# EAGLE board frontplatine_v0.2_140202 (EAGLE 6.3), part 1 of 2
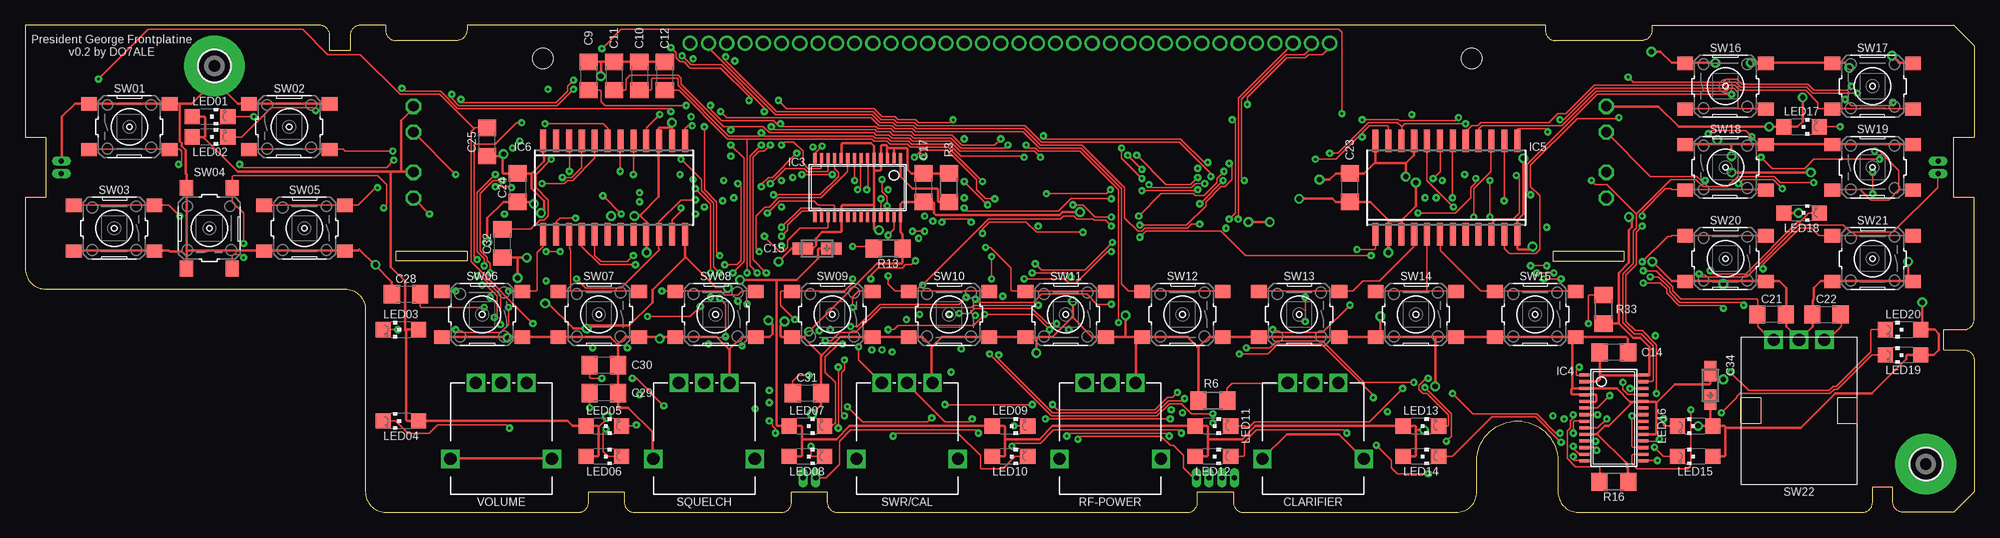
[diagram p2: board, top side]
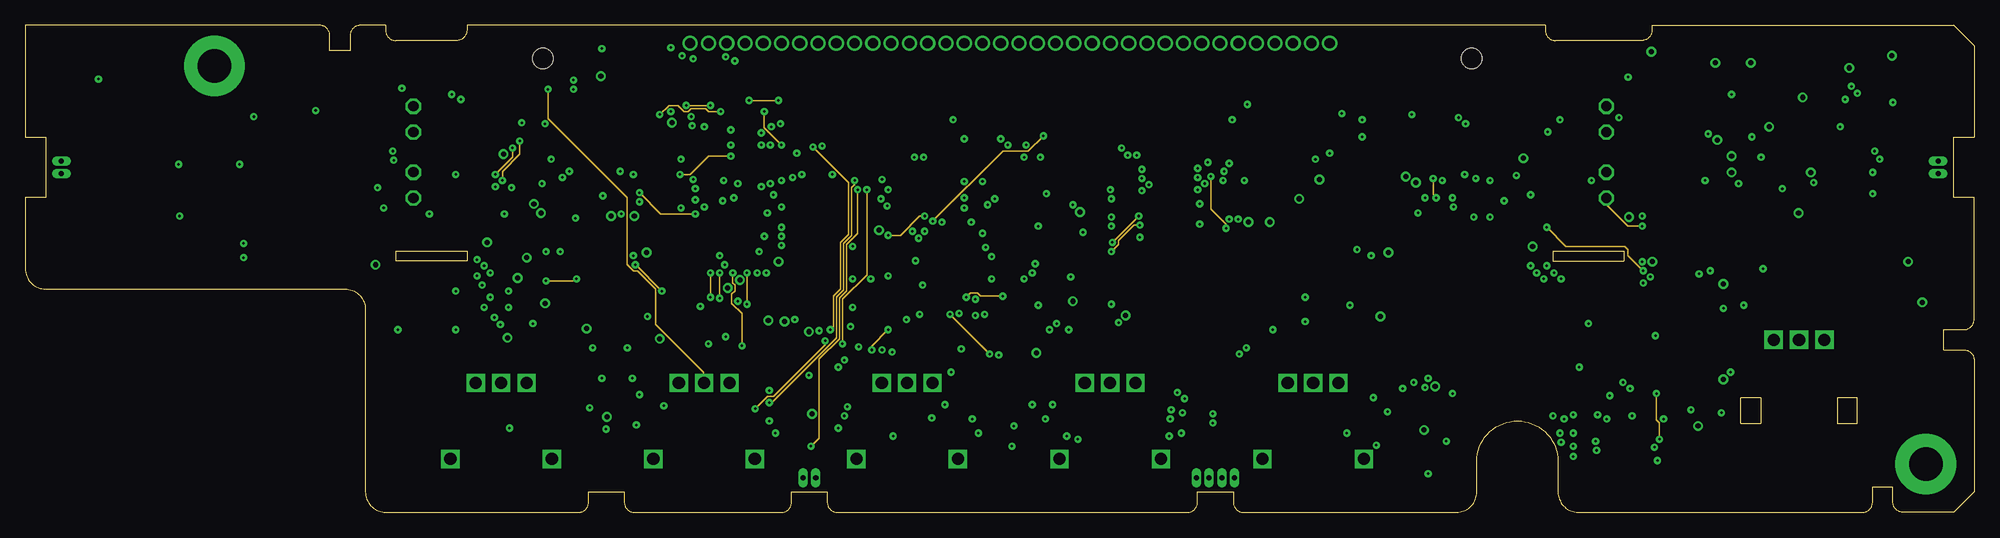
[diagram p3: board, inner layer Route2]
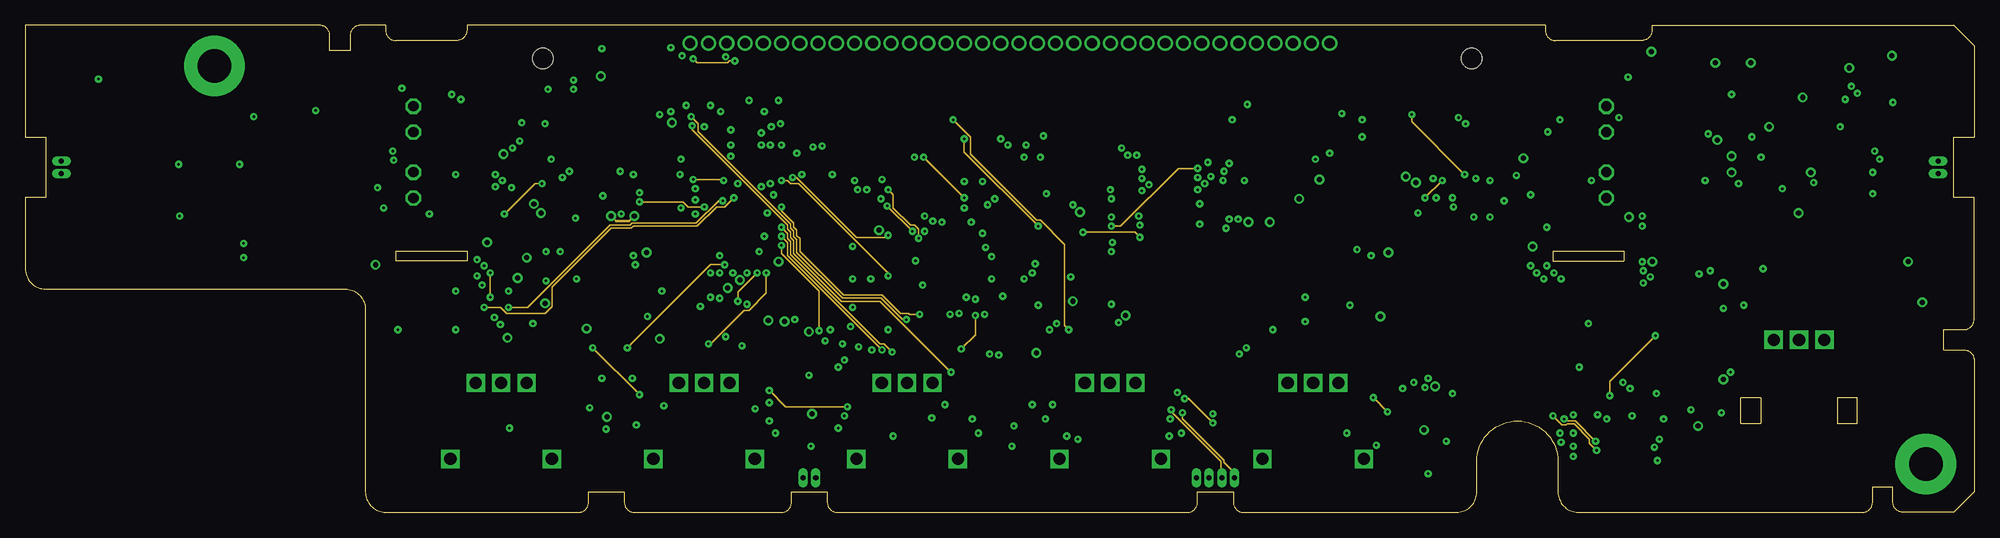
[diagram p4: board, inner layer Route3]
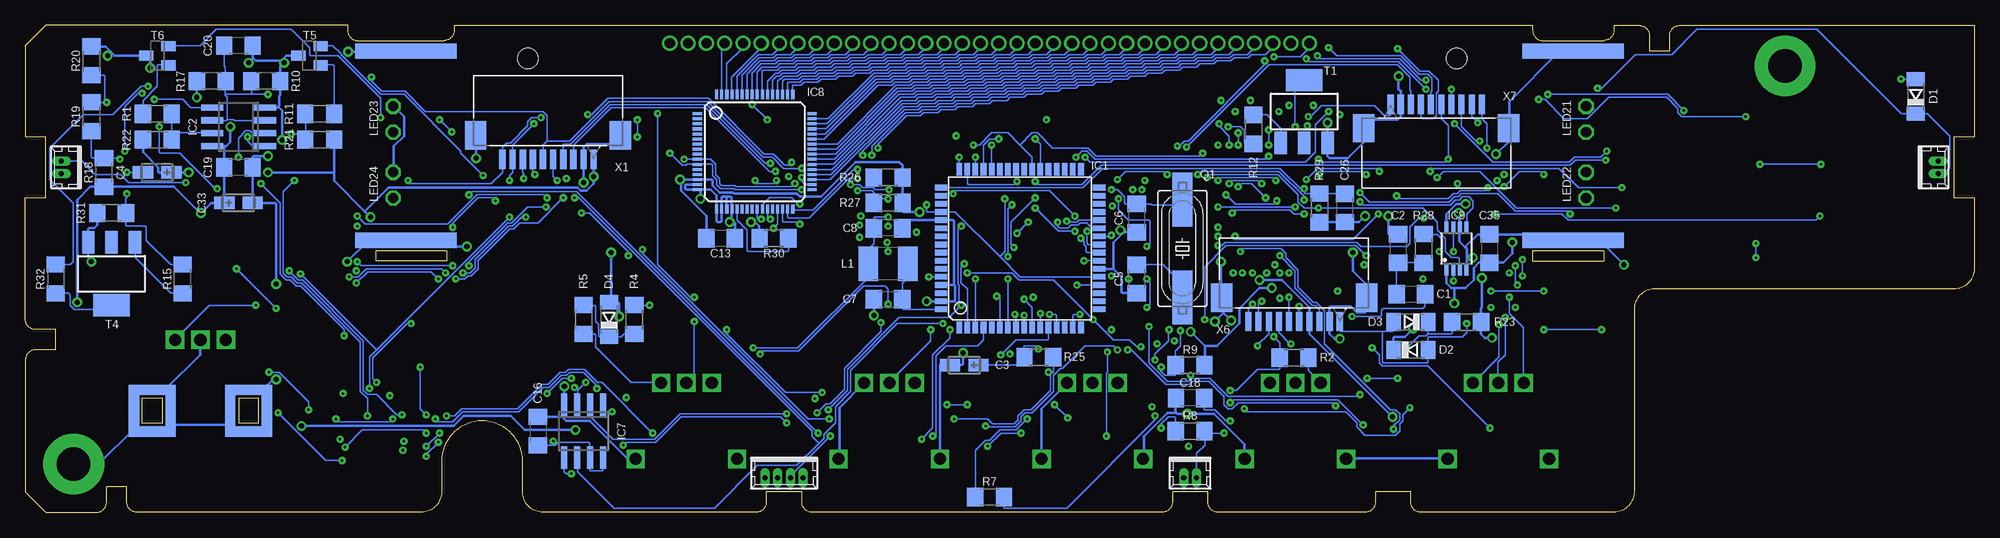
[diagram p5: board, bottom side, seen from below]

Size 192 x 48 mm. Coordinates in mm from the lower left corner, seen from the top.
Outline: 150.75,46.5 159.25,46.5 arc90 160.25,47.5 160.25,48
Outline: 43.5,48 149.75,48 149.75,47.5 arc90 150.76,46.5
Outline: 35.5,48 33,48 arc90 32,47 32,45.5 30,45.5 30,47 arc90 29,48 0,48 0,37 2,37 2,31 0,31 0,24 arc90 2,22 31.5,22 arc-90 33.5,20 33.5,2 arc90 35.5,0 54.5,0 arc90 55.5,1 55.5,2 59,2 59,1 arc90 60,0 74.5,0 arc90 75.5,1 75.5,2 79,2 79,1 arc90 80,0 114.5,0 arc90 115.5,1 115.5,2 119,2 119,1 arc90 120,0 141,0 arc90 143,2 143,5 arc-90 147,9 arc-90 151,5 151,2 arc90 153,0 181,0 arc90 182,1 182,2.5 184,2.5 184,1 arc90 185,0 190,0 192,2 192,15 arc90 191,16 189,16 189,18 191,18 arc90 192,19 192,31 190,31 190,37 192,37 192,46 190,48 160.25,48
Outline: 43.5,48 43.5,47.5 arc-90 42.5,46.5 36.5,46.5 arc-90 35.5,47.5 35.5,48
Copper layers (1*2+3*4+5*6+7*16): Top 0.035mm / dielectric 0.2mm / Route2 0.035mm / dielectric 0.15mm / Route3 0.035mm / dielectric 0.2mm / Route4 0.035mm / dielectric 0.15mm / Route5 0.035mm / dielectric 0.2mm / Route6 0.035mm / dielectric 0.15mm / Route7 0.035mm / dielectric 0.2mm / Bottom 0.035mm
Design rules "Eagle_WEdirekt_125_check": minimum track width 5mil, minimum drill 0.2mm, track to track 5mil, track to pad 5mil, pad to pad 7mil, via to via 5mil, smd to smd 7mil, copper to edge 12mil, drill to drill 24mil, minimum pad ring 9mil, minimum via ring 9mil, stop-mask expansion 2mil, vias tented up to drill 0mil, thermal gap 12mil
Net classes: 0 default: width 0.125 mm, drill 0.25 mm; 1 GND: width 0.25 mm, drill 0.5 mm; 2 SUPPLY LED: width 0.25 mm, drill 0.5 mm; 3 LCD: width 0.075 mm, drill 0.25 mm
tKeepout: area 184,8.5 to 187,11.5; area 160.5,11 to 163.5,14; area 163,0 to 166,3; area 37.5,3.5 to 40.5,6.5; area 149.5,11 to 152.5,14; area 92,11 to 95,14; area 36.5,11 to 39.5,14
tRestrict: area 190,37 to 192,40; area 73.5,0 to 81,2.3; area 53.5,0 to 61,2.3; area 113.5,0 to 121,2.3; area 0,37 to 2,40
bRestrict: area 190,37 to 192,40; area 73.5,0 to 81,2.3; area 53.5,0 to 61,2.3; area 113.5,0 to 121,2.3; area 0,37 to 2,40
vRestrict: area 190,37 to 192,40; area 73.5,0 to 81,2.3; area 53.5,0 to 61,2.3; area 113.5,0 to 121,2.3; area 0,37 to 2,40

## Footprints (pad centres in the part's own frame; a part is rotated, then mirrored left to right if it is on the bottom)
C1206 = smd 1.6 x 1.8: 1 -1.4,0; 2 1.4,0
CT3216 = smd 2 x 1.2: + -1.4,0; - 1.4,0
POTI = drill 1.2 square: 1 -2.5,-7.5; 2 0,-7.5; 3 2.5,-7.5; 4 -5,0; 5 5,0
SOD80C = smd 1.4 x 1.8: A 1.7,0; C -1.7,0
DISPLAY = drill 1 octagon: A1 1.73,15.27; A2 1.73,8.77; A3 119.27,15.27; A4 119.27,8.77; K1 1.73,12.73; K2 1.73,6.23; K3 119.27,12.73; K4 119.27,6.23 | drill 1: COM1 88.4,21.5; COM2 90.2,21.5; COM3 92,21.5; SEG01 29,21.5; SEG02 30.8,21.5; SEG03 32.6,21.5; SEG04 34.4,21.5; SEG05 36.2,21.5; SEG06 38,21.5; SEG07 39.8,21.5; SEG08 41.6,21.5; SEG09 43.4,21.5; SEG10 45.2,21.5; SEG11 47,21.5; SEG12 48.8,21.5; SEG13 50.6,21.5; SEG14 52.4,21.5; SEG15 54.2,21.5; SEG16 56,21.5; SEG17 57.8,21.5; SEG18 59.6,21.5; SEG19 61.4,21.5; SEG20 63.2,21.5; SEG21 65,21.5; SEG22 66.8,21.5; SEG23 68.6,21.5; SEG24 70.4,21.5; SEG25 72.2,21.5; SEG26 74,21.5; SEG27 75.8,21.5; SEG28 77.6,21.5; SEG29 79.4,21.5; SEG30 81.2,21.5; SEG31 83,21.5; SEG32 84.8,21.5; SEG33 86.6,21.5 | smd 10 x 1.5 bottom: GND@0 118,2.055; GND@3 3,2.055; GND@6 3,20.695; GND@7 118,20.695 | hole 2: 14.5,20; 106,20
TQFP64 = smd 1.194 x 0.559: 1 -7.8,6; 2 -7.8,5.2; 3 -7.8,4.4; 4 -7.8,3.6; 5 -7.8,2.8; 6 -7.8,2; 7 -7.8,1.2; 8 -7.8,0.4; 9 -7.8,-0.4; 10 -7.8,-1.2; 11 -7.8,-2; 12 -7.8,-2.8; 13 -7.8,-3.6; 14 -7.8,-4.4; 15 -7.8,-5.2; 16 -7.8,-6; 33 7.8,-6; 34 7.8,-5.2; 35 7.8,-4.4; 36 7.8,-3.6; 37 7.8,-2.8; 38 7.8,-2; 39 7.8,-1.2; 40 7.8,-0.4; 41 7.8,0.4; 42 7.8,1.2; 43 7.8,2; 44 7.8,2.8; 45 7.8,3.6; 46 7.8,4.4; 47 7.8,5.2; 48 7.8,6 | smd 0.559 x 1.194: 17 -6,-7.8; 18 -5.2,-7.8; 19 -4.4,-7.8; 20 -3.6,-7.8; 21 -2.8,-7.8; 22 -2,-7.8; 23 -1.2,-7.8; 24 -0.4,-7.8; 25 0.4,-7.8; 26 1.2,-7.8; 27 2,-7.8; 28 2.8,-7.8; 29 3.6,-7.8; 30 4.4,-7.8; 31 5.2,-7.8; 32 6,-7.8; 49 6,7.8; 50 5.2,7.8; 51 4.4,7.8; 52 3.6,7.8; 53 2.8,7.8; 54 2,7.8; 55 1.2,7.8; 56 0.4,7.8; 57 -0.4,7.8; 58 -1.2,7.8; 59 -2,7.8; 60 -2.8,7.8; 61 -3.6,7.8; 62 -4.4,7.8; 63 -5.2,7.8; 64 -6,7.8
SO08 = smd 0.6 x 2.2: 1 -1.905,-2.6; 2 -0.635,-2.6; 3 0.635,-2.6; 4 1.905,-2.6; 5 1.905,2.6; 6 0.635,2.6; 7 -0.635,2.6; 8 -1.905,2.6
TSSOP28 = smd 0.305 x 0.991: 1 -4.225,-2.918; 2 -3.575,-2.918; 3 -2.925,-2.918; 4 -2.275,-2.918; 5 -1.625,-2.918; 6 -0.975,-2.918; 7 -0.325,-2.918; 8 0.325,-2.918; 9 0.975,-2.918; 10 1.625,-2.918; 11 2.275,-2.918; 12 2.925,-2.918; 13 3.575,-2.918; 14 4.225,-2.918; 15 4.225,2.918; 16 3.575,2.918; 17 2.925,2.918; 18 2.275,2.918; 19 1.625,2.918; 20 0.975,2.918; 21 0.325,2.918; 22 -0.325,2.918; 23 -0.975,2.918; 24 -1.625,2.918; 25 -2.275,2.918; 26 -2.925,2.918; 27 -3.575,2.918; 28 -4.225,2.918
SO24 = smd 0.6 x 2.2: 1 -6.985,-4.6; 2 -5.715,-4.6; 3 -4.445,-4.6; 4 -3.175,-4.6; 5 -1.905,-4.6; 6 -0.635,-4.6; 7 0.635,-4.6; 8 1.905,-4.6; 9 3.175,-4.6; 10 4.445,-4.6; 11 5.715,-4.6; 12 6.985,-4.6; 13 6.985,4.6; 14 5.715,4.6; 15 4.445,4.6; 16 3.175,4.6; 17 1.905,4.6; 18 0.635,4.6; 19 -0.635,4.6; 20 -1.905,4.6; 21 -3.175,4.6; 22 -4.445,4.6; 23 -5.715,4.6; 24 -6.985,4.6
SO-08 = smd 0.6 x 2.2: 1 -1.905,-2.6; 2 -0.635,-2.6; 3 0.635,-2.6; 4 1.905,-2.6; 5 1.905,2.6; 6 0.635,2.6; 7 -0.635,2.6; 8 -1.905,2.6
LQFP-ST-64-2 = smd 0.9 x 0.3: 1 -5.65,3.75; 2 -5.65,3.25; 3 -5.65,2.75; 4 -5.65,2.25; 5 -5.65,1.75; 6 -5.65,1.25; 7 -5.65,0.75; 8 -5.65,0.25; 9 -5.65,-0.25; 10 -5.65,-0.75; 11 -5.65,-1.25; 12 -5.65,-1.75; 13 -5.65,-2.25; 14 -5.65,-2.75; 15 -5.65,-3.25; 16 -5.65,-3.75; 33 5.65,-3.75; 34 5.65,-3.25; 35 5.65,-2.75; 36 5.65,-2.25; 37 5.65,-1.75; 38 5.65,-1.25; 39 5.65,-0.75; 40 5.65,-0.25; 41 5.65,0.25; 42 5.65,0.75; 43 5.65,1.25; 44 5.65,1.75; 45 5.65,2.25; 46 5.65,2.75; 47 5.65,3.25; 48 5.65,3.75 | smd 0.3 x 0.9: 17 -3.75,-5.65; 18 -3.25,-5.65; 19 -2.75,-5.65; 20 -2.25,-5.65; 21 -1.75,-5.65; 22 -1.25,-5.65; 23 -0.75,-5.65; 24 -0.25,-5.65; 25 0.25,-5.65; 26 0.75,-5.65; 27 1.25,-5.65; 28 1.75,-5.65; 29 2.25,-5.65; 30 2.75,-5.65; 31 3.25,-5.65; 32 3.75,-5.65; 49 3.75,5.65; 50 3.25,5.65; 51 2.75,5.65; 52 2.25,5.65; 53 1.75,5.65; 54 1.25,5.65; 55 0.75,5.65; 56 0.25,5.65; 57 -0.25,5.65; 58 -0.75,5.65; 59 -1.25,5.65; 60 -1.75,5.65; 61 -2.25,5.65; 62 -2.75,5.65; 63 -3.25,5.65; 64 -3.75,5.65
MSOP8 = smd 0.4 x 1.2: 1 -0.975,-2.05; 2 -0.325,-2.05; 3 0.325,-2.05; 4 0.975,-2.05; 5 0.975,2.05; 6 0.325,2.05; 7 -0.325,2.05; 8 -0.975,2.05
L1812 = smd 1.9 x 3.4: 1 -1.95,0; 2 1.95,0
CHIPLED_1206 = smd 1.5 x 1.5: A 0,-1.75; C 0,1.75
LOCH = drill 3.3 pad 6: B3,0 0,0
HC49UP = smd 5.334 x 1.93: 1 -4.826,0; 2 4.826,0
R1206 = smd 1.6 x 1.803: 1 -1.422,0; 2 1.422,0
TASTER = smd 1.55 x 1.3: 1 -3.975,2.25; 2 3.975,2.25; 3 -3.975,-2.25; 4 3.975,-2.25
ROTARY_SWITCH = drill 1.2 square: A -2.5,-7; B 2.5,-7; C 0,-7 | smd 1 x 5.11 bottom: GND@1 -6.555,0; GND@2 -2.945,0; GND@3 6.555,0; GND@4 2.945,0 | smd 2.61 x 1 bottom: GND@5 -4.75,2.055; GND@6 -4.75,-2.055; GND@7 4.75,2.055; GND@8 4.75,-2.055
SOT223 = smd 1.219 x 2.235: 1 -2.311,-3.099; 2 0,-3.099; 3 2.311,-3.099 | smd 3.6 x 2.2: 4 0,3.099
SOT23-BEC = smd 1 x 1.4: B -0.95,-1.1; C 0,1.1; E 0.95,-1.1
MOLEX_52207-1085 = smd 0.61 x 1.905: 1 4.496,4.801; 2 3.505,4.801; 3 2.489,4.801; 4 1.499,4.801; 5 0.508,4.801; 6 -0.508,4.801; 7 -1.499,4.801; 8 -2.489,4.801; 9 -3.505,4.801; 10 -4.496,4.801 | smd 2.108 x 2.794: 11 -7.137,7.137; 12 7.137,7.137
53047-02 = drill 0.5 pad 0.698 long: 1 0.625,0.45; 2 -0.625,0.45
53047-04 = drill 0.5 pad 0.698 long: 1 1.875,0.45; 2 0.625,0.45; 3 -0.625,0.45; 4 -1.875,0.45

## Placement (x,y rotation side)
C1  0,047µF  [C1206]  55.5,21.5 0 bottom
C2  0,022µF  [C1206]  56.75,26 270 bottom
C3  22µF  [CT3216]  99.5,14.5 180 bottom
C4  10µF  [CT3216]  179,33.5 180 bottom
C5  22pF  [C1206]  82.5,23 90 bottom
C6  22pF  [C1206]  82.5,29 90 bottom
C7  100nF  [C1206]  107,21 0 bottom
C8  100nF  [C1206]  107,28 180 bottom
C9  1nF  [C1206]  55.5,43 270 top
C10  1nF  [C1206]  60.5,43 270 top
C11  1nF  [C1206]  58,43 270 top
C12  1nF  [C1206]  63,43 270 top
C13  100nF  [C1206]  123.5,27 180 bottom
C14  100nF  [C1206]  156.5,15.75 180 top
C15  22µF  [CT3216]  78,26 180 top
C16  100nF  [C1206]  141.5,8 270 bottom
C17  100nF  [C1206]  88.5,32 270 top
C18  1nF  [C1206]  77.25,11.25 180 bottom
C19  100nF  [C1206]  171,34 180 bottom
C20  1nF  [C1206]  171,46 180 bottom
C21  1µF  [C1206]  172.05,19.5 180 top
C22  1µF  [C1206]  177.45,19.5 0 top
C23  100nF  [C1206]  130.5,32 90 top
C24  100nF  [C1206]  48.5,32 270 top
C25  1nF  [C1206]  45.5,36.5 90 top
C26  1nF  [C1206]  62,30 90 bottom
C28  1nF  [C1206]  37.5,21.5 0 top
C29  1nF  [C1206]  57,11.75 180 top
C30  1nF  [C1206]  57,14.5 0 top
C31  1nF  [C1206]  77,11.75 0 top
C32  1nF  [C1206]  47,26.5 90 top
C33  22µF  [CT3216]  171,30.5 0 bottom
C34  22µF  [CT3216]  166,12.5 90 top
C35  100nF  [C1206]  47.75,26 270 bottom
CLARIFIER  POTI  [POTI]  126.88,5.25 180 top
D1  RLS4148  [SOD80C]  5.75,41 90 bottom
D2  RLS4148  [SOD80C]  55.5,16 0 bottom
D3  RLS4148  [SOD80C]  55.5,18.75 180 bottom
D4  RLZTE-115.1B  [SOD80C]  134.5,19 90 bottom
DISPLAY1  DISPLAY  [DISPLAY]  36.5,24.75 0 top
IC1  MEGA128-A  [TQFP64]  94,26 90 bottom
IC2  LM393D  [SO08]  171,38 90 bottom
IC3  TLC59116  [TSSOP28]  82,32 180 top
IC4  TLC59116  [TSSOP28]  156.5,9.3 270 top
IC5  PCA9555D  [SO24]  140,32 0 top
IC6  PCA9555D  [SO24]  58,32 180 top
IC7  25LC080SN  [SO-08]  137,8 180 bottom
IC8  PCF8576  [LQFP-ST-64-2]  120.14,35.54 0 bottom
IC9  ISL95811UFUZ  [MSOP8]  51,26 0 bottom
L1  10µH  [L1812]  107,24.5 180 bottom
LED01  G  [CHIPLED_1206]  18.2,39 270 top
LED02  R  [CHIPLED_1206]  18.2,37 270 top
LED03  G  [CHIPLED_1206]  37,18 90 top
LED04  R  [CHIPLED_1206]  37,9 90 top
LED05  G  [CHIPLED_1206]  57,8.5 270 top
LED06  R  [CHIPLED_1206]  57,5.5 270 top
LED07  G  [CHIPLED_1206]  77,8.5 270 top
LED08  R  [CHIPLED_1206]  77,5.5 270 top
LED09  G  [CHIPLED_1206]  97,8.5 270 top
LED10  R  [CHIPLED_1206]  97,5.5 270 top
LED11  G  [CHIPLED_1206]  117,8.5 270 top
LED12  R  [CHIPLED_1206]  117,5.5 270 top
LED13  G  [CHIPLED_1206]  137.5,8.5 270 top
LED14  R  [CHIPLED_1206]  137.5,5.5 270 top
LED15  G  [CHIPLED_1206]  164.5,5.5 90 top
LED16  R  [CHIPLED_1206]  164.5,8.5 90 top
LED17  G  [CHIPLED_1206]  175,38 270 top
LED18  R  [CHIPLED_1206]  175,29.5 270 top
LED19  G  [CHIPLED_1206]  185,15.5 90 top
LED20  R  [CHIPLED_1206]  185,18 90 top
LOCH1  LOCH  [LOCH]  18.62,44 0 top
LOCH2  LOCH  [LOCH]  187.25,4.75 0 top
Q1  Farnell: 1640903RL  [HC49UP]  78,26 90 bottom
R1  3,3k  [R1206]  179,39.27 0 bottom
R2  4,7k  [R1206]  67,15.25 180 bottom
R3  1k  [R1206]  91,32 270 top
R4  220  [R1206]  132,19 90 bottom
R5  4,7k  [R1206]  137,19 90 bottom
R6  33k  [R1206]  117,11 180 top
R7  1k  [R1206]  97,1.5 0 bottom
R8  1k  [R1206]  77.25,8 0 bottom
R9  47k  [R1206]  77.25,14.5 180 bottom
R10  220k  [R1206]  168.32,42.5 180 bottom
R11  3,3k  [R1206]  163,39.27 180 bottom
R12  3,3k  [R1206]  71,37.75 90 bottom
R13  10k  [R1206]  85,26 180 top
R15  47k  [R1206]  176.5,23 90 bottom
R16  1k  [R1206]  156.5,3 180 top
R17  220k  [R1206]  173.68,42.5 180 bottom
R18  10k  [R1206]  184.25,33.5 270 bottom
R19  1k  [R1206]  185.5,39 270 bottom
R20  10k  [R1206]  185.5,44.5 270 bottom
R21  3,3k  [R1206]  163,36.73 180 bottom
R22  3,3k  [R1206]  179,36.73 0 bottom
R23  220  [R1206]  50,18.75 180 bottom
R25  470  [R1206]  92.15,15.3 0 bottom
R26  10k  [R1206]  107,33 0 bottom
R27  10k  [R1206]  107,30.5 0 bottom
R28  50k  [R1206]  54.25,26 270 bottom
R29  47k  [R1206]  64.5,30 90 bottom
R30  0  [R1206]  118.25,27 0 bottom
R31  1M  [R1206]  183.5,29.5 180 bottom
R32  10k  [R1206]  189,23 270 bottom
R33  10k  [R1206]  155.5,20 90 top
RF-POWER  POTI  [POTI]  106.88,5.25 180 top
SQUELCH  POTI  [POTI]  66.88,5.25 180 top
SW01  [TASTER]  10.25,38 0 top
SW02  [TASTER]  26,38 0 top
SW03  [TASTER]  8.75,28 180 top
SW04  [TASTER]  18.12,28 90 top
SW05  [TASTER]  27.5,28 180 top
SW06  [TASTER]  45,19.5 180 top
SW07  [TASTER]  56.5,19.5 180 top
SW08  [TASTER]  68,19.5 180 top
SW09  [TASTER]  79.5,19.5 180 top
SW10  [TASTER]  91,19.5 180 top
SW11  [TASTER]  102.5,19.5 180 top
SW12  [TASTER]  114,19.5 180 top
SW13  [TASTER]  125.5,19.5 180 top
SW14  [TASTER]  137,19.5 180 top
SW15  [TASTER]  148.75,19.5 180 top
SW16  [TASTER]  167.5,42 0 top
SW17  [TASTER]  182,42 0 top
SW18  [TASTER]  167.5,34 0 top
SW19  [TASTER]  182,34 0 top
SW20  [TASTER]  167.5,25 180 top
SW21  [TASTER]  182,25 180 top
SW22  ROTARY_SWITCH  [ROTARY_SWITCH]  174.75,10 180 top
SWR/CAL  POTI  [POTI]  86.88,5.25 180 top
T1  PZT2222A  [SOT223]  66,39.5 0 bottom
T4  PZT2222A  [SOT223]  183.5,23.5 180 bottom
T5  BCX19SMD  [SOT23-BEC]  164,45 90 bottom
T6  BCX19SMD  [SOT23-BEC]  179,45 90 bottom
VOLUME  POTI  [POTI]  46.88,5.25 180 top
X1  52207-1085  [MOLEX_52207-1085]  140.5,30 0 bottom
X2  Goldcap  [53047-02]  4,34 270 bottom
X3  I/O  [53047-04]  117.25,3.85 180 bottom
X4  I2C  [53047-02]  188,34 90 bottom
X5  PTT/+-  [53047-02]  77.25,3.85 180 bottom
X6  52207-1085  [MOLEX_52207-1085]  67,14 0 bottom
X7  52207-1085  [MOLEX_52207-1085]  53,45 180 bottom

## Tracks (layer width: path | path; a pad name or v marks a point on that pad's centre or on a via)
GND  (via drill 0.5)
  Top 0.25: X2.2 3.6,34.7 3.6,39 4.9,40.3 6.2,40.3 SW01.1 6.3,40.3 14.2,40.3 SW01.2 14.3,40.3 15.2,40.3 | SW02.2 29.9,40.3 22.1,40.3 SW02.1 22,40.3 20.9,40.3 18.7,42.5 18.7,44 LOCH1.B3,0 18.6,42.5 16.4,40.3 15.2,40.3 | C28.1 36.1,22.7 34.45,24.35 | 34.45,24.35 32.9,25.9 32.8,25.8 31.5,25.8 SW05.1 31.4,25.8 23.6,25.8 SW05.2 23.5,25.8 15.9,25.8 | SW03.2 4.8,25.8 12.7,25.8 SW03.1 12.8,25.8 14.1,25.8 14.2,25.7 15.4,25.7 15.9,25.2 | 15.9,25.2 15.9,24.1 SW04.1 | 15.9,25.2 15.9,25.8 | 15.9,25.8 15.9,31.9 SW04.2 15.9,32.1 15.9,33.3 15.8,33.4 15.8,35.7 15.4,36.1 15.4,36.4 15.2,36.6 15.2,40.3 | v49.4,25.1 48.5,25.1 | 48.5,25.1 C32.1 | 49.9,33.4 C24.1 47.1,33.4 47,33.5 47,34.8 46.8,35 | 49.9,33.4 51.1,34.6 51.1,35.1 51,35.2 IC6.12 | C25.1 46.7,35.1 46.8,35 | 46.8,35 v47.1,35.3 | v50.8,29.5 51.1,29.8 51.1,30.7 49.9,31.9 49.9,33.4 | v34.5,24.4 34.45,24.35 | 56.7,44.4 C11.1 C10.1 C12.1 | 56.7,44.4 C9.1 | 63.6,37.9 62.5,37.9 62.4,37.8 62.4,36.6 IC6.3 62.4,36.5 62.4,31.1 60.6,29.3 60.6,29.2 | 63.6,37.9 63.7,37.8 63.7,36.6 IC6.2 | v63.7,38.4 63.7,37.9 63.6,37.9 | v56.7,43 56.7,44.4 | VOLUME.5 41.9,5.3 51.8,5.3 VOLUME.4 | 47.5,17.3 48.9,17.3 SW06.1 49,17.3 52.5,17.3 SW07.2 52.6,17.3 57.6,17.3 58.3,16.6 58.4,16.6 | 47.5,17.3 41.1,17.3 SW06.2 | v47.5,17.2 47.5,17.3 | 60.6,29.2 61.2,28.6 61.2,27.4 IC6.21 61.2,27.3 v61.2,25.6 | v60,29.2 60.6,29.2 | 62.5,17.3 64,17.3 SW08.2 64.1,17.3 68.1,17.3 69.3,16.1 69.4,16.1 | 62.5,17.3 60.5,17.3 SW07.1 60.4,17.3 59.1,17.3 58.4,16.6 | v62.5,17.1 62.5,17.3 | 58.4,16.6 C30.2 C29.1 58.4,10.4 58.5,10.3 59.4,10.3 61.8,7.9 61.8,5.3 SQUELCH.5 | R3.1 91,33.4 C17.1 87.3,33.4 86.9,33.8 86.9,35.8 86.8,35.9 85.6,35.9
  Top 0.25: 84.9,35.9 84.9,35 IC3.3 | 84.9,35.9 84.9,36.1 84.8,36.2 84.4,36.2 84.3,36.1 84.3,35 IC3.4 84.3,34.8 84.3,33.8 84.2,33.7 83.7,33.7 | 85.6,35.9 85.6,35 IC3.2 | 84.9,35.9 85.6,35.9 | IC3.10 80.4,35 80.4,36.3 80.5,36.4 83.3,36.4 83.6,36.1 83.6,35 IC3.5 83.6,34.8 83.6,33.8 83.7,33.7 | 83.5,30.3 80.5,30.3 80.4,30.2 80.4,29.1 IC3.19 80.4,29 80.4,27.7 80.3,27.6 78.5,27.6 77.9,27 77.9,26.3 77.6,26 C15.- 75.5,26 v74.2,24.7 | 83.5,30.3 83.6,30.2 83.6,29.1 IC3.24 83.6,29 83.6,27.9 83.7,27.8 v84.1,27.8 | 83.7,33.7 83.6,33.7 83.6,30.3 83.5,30.3 | 99.6,17.2 v99.6,15.7 | 99.6,17.2 99.5,17.3 98.6,17.3 SW11.2 98.5,17.3 95,17.3 SW10.1 94.9,17.3 90.3,17.3 89.4,16.4 89.3,16.4 | v77.5,9.7 78.4,10.6 C31.2 78.4,15.5 | v73.2,18.9 73.6,18.5 73.6,17.6 73.3,17.3 72,17.3 SW08.1 71.9,17.3 70.6,17.3 69.4,16.1 | v74.8,18.8 74.4,18.4 74.4,17.4 74.5,17.3 75.5,17.3 SW09.2 75.6,17.3 76.6,17.3 78.4,15.5 | 78.4,15.5 78.5,15.5 80.3,17.3 83.4,17.3 SW09.1 83.5,17.3 87,17.3 SW10.2 87.1,17.3 88.4,17.3 89.3,16.4 | 69.4,16.1 69.4,12.8 SQUELCH.1 | 89.3,16.4 89.3,12.8 SWR/CAL.1 | v48.5,23.1 48.5,25.1 | 168.1,36.3 171.4,36.3 SW18.2 171.5,36.3 178,36.3 SW19.1 178.1,36.3 185.9,36.3 SW19.2 | 168.1,36.3 166.7,36.3 | 166.7,36.3 163.6,36.3 SW18.1 | 168.1,36.3 v168.1,35.1 | v166.5,44.3 163.6,44.3 SW16.1 163.5,44.3 162.2,44.3 161.1,45.4 v160.2,45.4 | v170,44.3 171.4,44.3 SW16.2 171.5,44.3 178,44.3 SW17.1 178.1,44.3 179.2,44.3 v179.7,43.8 | v183.9,45 184.6,44.3 185.9,44.3 SW17.2 | v166.7,36.7 166.7,36.3 | v147.6,34.9 147.6,29.4 147,28.8 147,27.4 IC5.12 147,27.3 147,26 147.1,25.9 148.2,25.9 v148.5,26.2 | 167.3,22.8 171.4,22.8 SW20.1 171.5,22.8 172.8,22.8 173.5,22.1 173.5,19.5 C21.1 173.5,19.4 173.5,18.3 174.7,17.1 SW22.C 174.8,17 176.1,18.3 176.1,19.4 C22.1 176.1,19.5 176.1,20.9 176.2,21 176.2,22.1 176.9,22.8 178,22.8 SW21.2 178.1,22.8 185.4,22.8 SW21.1 185.9,22.8 185.5,22.8 v185.5,24.7
  Top 0.25: 167.3,22.8 163.6,22.8 SW20.2 163.5,22.8 162.2,22.8 v160.3,24.7 | 167.3,22.8 v167.3,22.5 | 108.4,17.3 110,17.3 SW12.2 | 108.4,17.3 106.5,17.3 SW11.1 106.4,17.3 105.1,17.3 103.2,19.2 | 108.4,17.3 v108.4,19.4 | 103.2,19.2 v103.2,20.8 | RF-POWER.1 109.4,12.8 109.4,17.2 SW12.2 | v122.6,28.6 v120.5,28.6 | 134.3,28.7 134.3,27.4 IC5.2 134.3,27.3 v134.3,25.6 | 134.3,28.7 134.3,28.8 132.5,30.6 C23.1 129.1,30.6 128.8,30.9 v125.5,30.9 | 135.5,28.7 135.6,28.6 135.6,27.4 IC5.3 | 134.3,28.7 135.5,28.7 | v137,32.5 137,30.2 135.5,28.7 | CLARIFIER.5 121.9,5.3 124.3,7.7 129.4,7.7 131.8,5.3 CLARIFIER.4 | v167.3,13.1 166,13.1 C34.- 166,12.7 165.9,12.6 162.5,12.6 160.7,10.8 | 154.9,7.7 153.6,7.7 IC4.10 | 154.9,7.7 157.8,4.8 157.8,4.5 157.9,4.4 157.9,3 R16.1 | IC4.5 153.6,10.9 154.7,10.9 154.8,11 154.8,11.5 154.7,11.6 153.6,11.6 IC4.4 153.5,11.6 152.4,11.6 152.3,11.7 152.3,12.1 152.4,12.2 | 152.4,12.2 153.5,12.2 IC4.3 153.7,12.2 156.8,12.2 158.1,10.9 158.3,10.9 | 160.7,10.8 160.7,7.8 160.6,7.7 159.5,7.7 IC4.19 | 160.7,10.8 160.6,10.9 159.5,10.9 IC4.24 159.3,10.9 158.3,10.9 | 154.9,7.7 154.9,7.8 155.6,8.5 156,8.5 158.3,10.8 158.3,10.9 | 115.6,16.3 115.6,11 R6.2 | 115.6,16.3 116.6,17.3 117.9,17.3 SW12.1 118,17.3 121.5,17.3 SW13.2 121.6,17.3 129.4,17.3 SW13.1 129.5,17.3 133,17.3 SW14.2 | C14.1 157.9,17.1 157.7,17.3 152.8,17.3 SW15.1 | v133.5,19.3 133.5,17.3 133.1,17.3 SW14.2 | 138.9,17.3 133.6,17.3 SW14.2 | 138.9,17.3 140.9,17.3 SW14.1 141,17.3 144.7,17.3 SW15.2 144.8,17.3 152.7,17.3 SW15.1 | 152.4,12.2 152.4,17.2 SW15.1 | 138.9,17.3 v138.9,12.4 | SW12.2 110.1,17.3 114.5,17.3 115.5,16.3 115.6,16.3
  Top 0.25: 99.6,17.2 99.7,17.2 99.8,17.3 101.2,17.3 103.1,19.2 103.2,19.2
  Route3 0.25: v57.7,29.2 58.2,28.7 59.5,28.7 v60,29.2
  Bottom 0.25: 39.5,45.5 DISPLAY1.GND@6 39.6,45.4 40.9,45.4 45.8,40.5 45.8,39.3 45.9,39.2 45.9,37.9 X7.11 45.9,37.8 45.9,36.5 v47.1,35.3 | 50.1,24 IC9.4 50,24 50,25.1 | 50,25.1 50,26 50.15,26.15 | 50.15,26.15 50.7,26.7 50.7,28 IC9.6 50.7,28.1 50.7,29.4 v50.8,29.5 | 50,25.1 v49.4,25.1 | 50.15,26.15 48.9,27.4 C35.1 41.5,27.4 40.9,26.8 DISPLAY1.GND@3 39.4,26.8 38.1,26.8 37.5,26.2 36.3,26.2 v34.5,24.4 | v63.7,38.4 63.7,36.5 T1.3 63.7,36.3 63.7,35.1 63.5,34.9 61.7,34.9 60.1,36.5 60.1,37.8 X7.12 60.1,37.9 60.1,38.6 60,38.7 56.8,38.7 56.5,39 56.5,40.1 X7.2 56.5,40.3 56.5,41.5 56.7,41.7 v56.7,43 | v47.5,17.2 48.2,17.2 48.6,17.6 48.6,18.7 R23.1 48.6,18.8 48.6,20.1 48.5,20.2 v48.5,23.1 | C2.1 57.6,27.4 57.7,27.5 v57.7,29.2 | v60,29.2 60.6,28.6 C26.1 64.5,28.6 R29.1 | v62.5,17.1 63,17.1 63.5,17.6 X6.2 63.5,18.9 63.5,20.2 63.4,20.3 61.4,20.3 60.8,19.7 60,19.7 59.9,19.8 59.9,21.1 X6.12 59.9,21.2 59.9,22.5 61.2,23.8 v61.2,25.6 | VOLUME.4 51.9,5.3 61.8,5.3 SQUELCH.5 | 84.8,24 IC1.22 | 84.8,24 84,23.2 84,21.7 83.9,21.6 C5.1 | C6.1 83.9,27.6 v84.1,27.8 83.9,27.5 84.8,26.6 84.8,24 | v99.6,15.7 99.6,14.6 99.7,14.5 C3.- 101.9,14.5 101.9,5.3 RF-POWER.5 | SWR/CAL.4 91.9,5.3 91.9,10.2 89.4,12.7 SWR/CAL.1 | 78.65,9.85 78.7,9.9 78.7,11.2 C18.2 | 78.65,9.85 78.5,9.7 v77.5,9.7 74.9,9.7 71.9,6.7 71.9,5.3 SQUELCH.4 | 73.95,19.65 74.1,19.8 74.1,21.1 X6.11 74.1,21.2 74.1,22.5 74.2,22.6 v74.2,24.7 | 73.95,19.65 v73.2,18.9 | 73.95,19.65 v74.8,18.8 | SWR/CAL.5 81.8,5.3 81.8,7.5 79.5,9.8 78.7,9.8 78.65,9.85 | v168.1,35.1 169.5,35.1 169.6,35 C19.1 C33.- 167.4,30.5 167.3,30.4 v167.3,22.5 | 154.5,45.5 DISPLAY1.GND@7 154.6,45.4 v160.2,45.4
  Bottom 0.25: T5.C 166.3,45 166.8,44.5 166.8,44.3 | 166.8,44.3 166.8,44 166.9,43.9 R10.1 166.9,42.4 166.9,41.1 167,41 167,40.1 167.1,40 | 166.8,44.3 v166.5,44.3 166.9,44.5 169.3,44.5 169.5,44.7 169.6,44.7 | 167.1,40 167.2,39.9 IC2.4 | 169.6,44.7 v170,44.3 | C20.1 169.6,44.7 | 183.55,45.35 184.1,45.9 185.5,45.9 R20.1 | 183.55,45.35 183.2,45 T6.C 179.7,45 v179.7,43.8 | 183.55,45.35 v183.9,45 | v166.7,36.7 166.7,39.6 167.1,40 | v147.6,34.9 147.6,37.1 X1.11 | v148.5,26.2 152.5,26.2 153.1,26.8 DISPLAY1.GND@0 154.6,26.8 158.2,26.8 v160.3,24.7 | v185.5,24.7 185.5,24.9 185.8,25.2 185.8,26.5 T4.3 185.8,26.7 185.8,27.9 185.7,28 185.2,28 184.9,28.3 184.9,29.5 R31.2 | RF-POWER.4 111.8,5.3 111.8,10.3 109.4,12.7 RF-POWER.1 | C8.1 105.6,28.8 IC1.53 100.6,28.8 100.5,28.7 100.5,22.4 | 100.5,22.4 100.4,22.3 100.4,20.8 IC1.63 v103.2,20.8 | IC1.61 100.5,22.4 | v108.4,19.4 C7.1 | 122.8,31.1 122.5,31.1 122.4,31 IC8.20 122.4,29.8 122.4,28.8 122.25,28.65 | 122.8,31.1 122.9,31 IC8.19 | 122.8,31.1 123.3,31.1 123.4,31 IC8.18 123.4,29.8 123.4,28.7 123.5,28.6 123.8,28.6 123.9,28.7 123.9,29.8 IC8.17 123.9,31.2 124.5,31.8 125.7,31.8 IC8.16 | IC8.15 126.9,32.3 127,32.2 127,31.9 126.9,31.8 125.9,31.8 IC8.16 | C13.1 122.1,28.5 122.25,28.65 | v120.5,28.6 120.1,28.6 119.7,28.2 119.7,27 R30.1 | v122.6,28.6 122.3,28.6 122.25,28.65 | X1.12 133.4,37.1 133.4,36.4 133.5,36.3 136.7,36.3 137,36 137,34.9 X1.2 137,34.7 v137,32.5 | v125.5,30.9 125.5,31.7 IC8.16 | 138.9,9.4 IC7.4 | 138.9,9.4 138.9,9.2 138.7,9 136.4,9 132.7,5.3 131.9,5.3 CLARIFIER.4 | 138.9,9.4 C16.1 | 139,10.6 IC7.4 | SW22.GND@2 | 179.5,12.1 SW22.GND@6 | 179.5,8 SW22.GND@5 179.6,7.9 180.9,7.9 181.2,8.2 181.2,8.5 181.3,8.6 SW22.GND@1
  Bottom 0.25: SW22.GND@6 179.6,12.1 180.9,12.1 181.2,11.8 181.2,11.5 181.3,11.4 181.3,10.1 SW22.GND@1 | SW22.GND@2 177.7,10.1 177.7,11.7 178.1,12.1 179.4,12.1 SW22.GND@6 | 181.4,10 SW22.GND@1 | SW22.GND@3 168.2,9.9 168.2,8.3 168.6,7.9 169.9,7.9 SW22.GND@7 | 170,8 SW22.GND@7 | SW22.GND@7 170.1,7.9 171.4,7.9 171.7,8.2 171.7,8.5 171.8,8.6 SW22.GND@4 | v167.3,13.1 167.6,13.1 168.6,12.1 170,12.1 SW22.GND@8 170.1,12.1 171.4,12.1 171.7,11.8 171.7,11.5 171.8,11.4 171.8,10.1 SW22.GND@4 | 171.9,10 SW22.GND@4 | SW22.GND@2 177.7,9.9 177.7,8.6 171.9,8.6 SW22.GND@4 | v133.5,19.3 133.5,20.6 133.6,20.7 D4.A 134.3,20.8 v134.3,25.6 | v138.9,12.4 138.9,10.7 IC7.4 | LOCH2.B3,0 187.2,4.8 184.7,4.8 181.3,8.2 SW22.GND@1 | SW22.C 174.8,17 174.8,15.5 178.1,12.2 SW22.GND@2
N$1  (via drill 0.25)
  Top 0.127: v116.8,33.1 116.8,33.4 113.7,36.5 100.1,36.5 98.5,38.1 87.9,38.1 87.6,38.4 85.9,38.4 85.6,38.7 84.3,38.7 83.5,39.5 74,39.5 69,44.5 v69,44.9
  Route2 0.127: v118.3,28 118.3,28.4 116.8,29.9 v116.8,33.1
  Bottom 0.127: v118.3,28 117.9,28.4 117.9,29.8 IC8.29 | v69,44.9 66.4,44.9 65.5,45.8 DISPLAY1.SEG01
N$2  (via drill 0.25)
  Top 0.127: v46.3,33.3 44.5,31.5 44.5,25.7 45.2,25 v45.2,24.3 | v45,22.4 45.4,22.4 46.5,21.3 46.5,19.5 v46.2,19.2
  Route2 0.127: v48,35.9 48,35 v46.3,33.3
  Bottom 0.127: v48,35.9 48,38.3 48.5,38.8 48.5,40.1 X7.10 | v45.2,24.3 45.2,22.6 v45,22.4 | v46.2,19.2 46.2,15.5 46.9,14.8 46.9,12.8 VOLUME.2
N$3  (via drill 0.25)
  Top 0.127: v48.9,38.4 48.4,38.4 46.3,36.3 44.3,36.3 44.2,36.2 44.2,25.2 v44.5,24.9 | v44.5,23.3 44.9,23.3 46.8,21.4 v46.8,18.5
  Bottom 0.127: v48.9,38.4 49.5,39 49.5,40.1 X7.9 | v44.5,23.3 v44.5,24.9 | v46.8,18.5 46.8,15.3 49.3,12.8 VOLUME.1
N$4  (via drill 0.25)
  Top 0.127: v47,32.7 46.1,32.7 44.8,31.4 44.8,25.8 45.5,25.1 45.5,24.8 45.8,24.5 v45.8,23.6
  Route2 0.127: v48.7,36.6 48.7,35.3 47,33.6 v47,32.7
  Route3 0.127: v45.8,21.2 v45.8,23.6
  Bottom 0.127: v48.7,36.6 49.1,36.6 50.5,38 50.5,40.1 X7.8 | v45.8,21.2 45.8,19.6 44.4,18.2 44.4,12.8 VOLUME.3
N$5
  Bottom 0.127: R4.1 132,17.6 133,17.6 133.3,17.3 D4.C 135.4,17.3 135.5,17.4 135.5,18.5 135.8,18.8 135.8,20.3 135.9,20.4 137,20.4 R5.2
N$6  (via drill 0.25)
  Route2 0.127: v51.5,41.7 51.5,38.8 59.3,31 59.3,24.4 59.9,23.8 60.3,23.8 62.1,22 62.1,18.5 66.8,13.8 66.8,12.8 SQUELCH.2
  Bottom 0.127: v51.5,41.7 X7.7
N$7
  Bottom 0.127: R2.1 65.6,15.2 65.6,14 64.4,12.8 SQUELCH.3
N$9  (via drill 0.25)
  Top 0.127: C32.2 49.8,27.9 50.7,28.8 51.1,28.8 51.5,29.2 51.5,30.8 50.3,32 50.3,33.3 v51.8,34.8 | v69,17.3 69,20.5 v68.4,21.1 | v68.4,23.6 67.8,24.2 67.8,30.5 66.6,31.7 66.6,32.8 v64.6,34.8 | v130.5,20.4 127.8,17.7 123.2,17.7 v122.9,18 | v113.5,11.8 113,11.3 112.5,11.3 111.3,10.1 101.7,10.1 v101.2,10.6 | v90.6,10.6 v99.2,10.6 | v89.3,9.3 88.9,8.9 82.5,8.9 v81,10.4
  Route2 0.127: v68.4,23.6 v68.4,21.1
  Route3 0.127: v81,10.4 74.9,10.4 v73.3,12
  Bottom 0.127: X7.6 52.5,40.1 52.5,38.8 51.8,38.1 v51.8,34.8 52.1,34.5 64.3,34.5 v64.6,34.8 | v69,17.3 68.4,16.7 68.4,15.3 R2.2 68.4,15.2 68.4,14.2 68.5,14.1 70.6,14.1 72.7,12 v73.3,12 | v130.5,20.4 132,20.4 R4.2 | v122.9,18 122.9,17.6 117.1,11.8 v113.5,11.8 | v99.2,10.6 v101.2,10.6 | v89.3,9.3 v90.6,10.6
N$10
  Bottom 0.127: R5.1 137,17.6 135.9,17.6 135.8,17.5 135.8,16.3 132.3,12.8 129.4,12.8 CLARIFIER.1
N$11  (via drill 0.25)
  Top 0.127: v56.8,45.7 58.7,47.6 129.4,47.6 129.7,47.3 v129.7,39.3 | v126.1,18.8 v126.1,21.2
  Bottom 0.127: v56.8,45.7 54.6,43.5 53.7,43.5 52.8,42.6 52.8,41.5 53,41.3 53,39.1 53.3,38.8 54.3,38.8 54.5,39 54.5,40.1 X7.4 | v129.7,39.3 129.7,24.4 126.5,21.2 v126.1,21.2 | v126.1,18.8 126.1,13.5 126.8,12.8 CLARIFIER.2
N$12
  Top 0.127: R6.1 118.4,11 118.4,12.2 118.9,12.7 124.3,12.7 CLARIFIER.3
N$13  (via drill 0.25)
  Top 0.127: v82.9,31.8 83,31.9 83,34.9 IC3.6 | v80.5,16.6 80.1,16.6 78.8,15.3 78.8,13.8 79.8,12.8 79.8,8.8 79.5,8.5 LED07.C
  Route2 0.127: v82.9,31.8 82.9,23.4 80.5,21 v80.5,16.6
N$14  (via drill 0.25)
  Top 0.127: v80.7,9.5 80.4,9.8 80.4,13.8 80.7,14.1 v80.7,15
  Route2 0.127: v79.3,18 79.6,18.3 79.6,21.3 80.3,22 80.3,26.6 81.1,27.4 81.1,32.5 v77.6,36
  Bottom 0.127: v80.7,9.5 80.7,9.1 89.4,0.4 95.6,0.4 95.6,1.5 R7.2 | v80.7,15 80.7,15.6 79.4,16.9 79.4,17.9 v79.3,18 | v77.6,36 69.5,44.1 56.8,44.1 55.6,42.9 55.6,41.6 55.5,41.5 X7.3
N$15  (via drill 0.25)
  Top 0.127: v93.3,9.2 93,8.9 90.6,8.9 86.8,12.7 SWR/CAL.2
  Bottom 0.127: v93.3,9.2 94.4,8.1 96,8.1 97,7.1 97.4,7.1 98.4,6.1 98.4,1.5 R7.1
N$16  (via drill 0.25)
  Top 0.127: v115.7,28.4 114.9,28.4 114.5,28 110.3,28 110,27.7 109.6,27.7 108.3,29 108.3,32 104.1,36.2 100,36.2 98.4,37.8 87.8,37.8 87.5,38.1 85.8,38.1 85.5,38.4 84.2,38.4 83.4,39.2 73.9,39.2 67.3,45.8 DISPLAY1.SEG02
  Bottom 0.127: v115.7,28.4 115.9,28.6 117.3,28.6 117.4,28.7 117.4,29.8 IC8.30
N$17  (via drill 0.25)
  Top 0.127: v80.1,14.3 v80.1,8.3 | v54.2,29 52.7,29 52.3,28.6 52.3,27.4 IC6.14
  Route3 0.127: v74.5,26.3 74.5,25.5 78.2,21.8 v78.2,17.9
  Bottom 0.127: v80.1,8.3 80.1,8.7 79.4,9.4 78.8,9.4 78.7,9.3 78.7,8 R8.1 | v80.1,14.3 80.1,13.9 79.7,13.5 78.7,13.5 78.7,14.5 | v54.2,29 54.7,29 55.6,28.1 55.6,26.5 55.9,26.2 60.4,26.2 60.8,26.6 73.8,26.6 74.1,26.3 v74.5,26.3 | v78.2,17.9 78.2,16.4 78.7,15.9 78.7,14.5 | 78.7,14.5 R9.2
N$18  (via drill 0.25)
  Top 0.127: v73.3,9 73.6,8.7 73.6,8.5 73.9,8.2 v73.9,7.8
  Bottom 0.127: v73.3,9 73.7,9 74.8,10.1 75.8,10.1 75.9,10.2 75.9,11.2 C18.1 | 75.8,7.8 v73.9,7.8 | 75.8,7.8 75.8,8 R8.2 75.8,7.8 | 75.8,7.8 75.8,6.6 76.6,5.8 76.6,3.4 X5.2
N$19  (via drill 0.25)
  Top 0.127: SW05.4 23.6,30.3 31.4,30.3 SW05.3 31.5,30.3 32.8,30.3 34.5,32 v34.7,32 | v53.6,33.6 53.6,36.6 IC6.10
  Bottom 0.127: v53.6,33.6 53.3,33.9 40.9,33.9 39,32 v34.7,32
N$20  (via drill 0.25)
  Top 0.127: v68.4,25.3 68.1,25.6 68.1,30.6 66.9,31.8 v66.9,38
  Bottom 0.127: v68.4,25.3 66.9,23.8 66.9,22.1 65.2,20.4 64.9,20.4 64.5,20 64.5,18.9 X6.3 | v66.9,38 66.9,42.5 66.8,42.6 T1.4
N$21  (via drill 0.25)
  Top 0.127: v110,32.9 108,34.9 v108,35.9
  Bottom 0.127: v110,32.9 110.9,32.9 114.8,29 116.8,29 116.9,29.1 116.9,29.8 IC8.31 | v108,35.9 108,36.3 105.2,39.1 103.8,39.1 103.5,39.4 102.1,39.4 101.8,39.7 100.4,39.7 100.1,40 98.7,40 98.4,40.3 97,40.3 96.7,40.6 95.3,40.6 95,40.9 93.6,40.9 93.3,41.2 91.9,41.2 91.6,41.5 90.2,41.5 89.9,41.8 88.5,41.8 88.2,42.1 86.8,42.1 86.5,42.4 85.1,42.4 84.8,42.7 83.4,42.7 83.1,43 81.7,43 81.4,43.3 80,43.3 79.7,43.6 78.3,43.6 78,43.9 76.6,43.9 76.3,44.2 74.9,44.2 74.6,44.5 73.2,44.5 72.9,44.8 71.5,44.8 71.2,45.1 69.8,45.1 69.1,45.8 DISPLAY1.SEG03
N$22  (via drill 0.25)
  Top 0.127: v108.6,35.2 v110,33.8
  Bottom 0.127: v110,33.8 110.4,33.8 114.4,29.8 116.3,29.8 IC8.32 | v108.6,35.2 108.6,36.1 105.3,39.4 103.9,39.4 103.6,39.7 102.2,39.7 101.9,40 100.5,40 100.2,40.3 98.8,40.3 98.5,40.6 97.1,40.6 96.8,40.9 95.4,40.9 95.1,41.2 93.7,41.2 93.4,41.5 92,41.5 91.7,41.8 90.3,41.8 90,42.1 88.6,42.1 88.3,42.4 86.9,42.4 86.6,42.7 85.2,42.7 84.9,43 83.5,43 83.2,43.3 81.8,43.3 81.5,43.6 80.1,43.6 79.8,43.9 78.4,43.9 78.1,44.2 76.7,44.2 76.4,44.5 75,44.5 74.7,44.8 73.3,44.8 73,45.1 71.6,45.1 70.9,45.8 DISPLAY1.SEG04
N$23  (via drill 0.25)
  Top 0.127: v82,31.8 82.3,32.1 82.3,34.9 IC3.7 | v77.4,6.5 77.4,5.6 77.5,5.5 LED08.C
  Route2 0.127: v82,31.8 82,27.5 80.9,26.4 80.9,21.8 80.2,21.1 80.2,17.1 78.2,15.1 78.2,7.3 v77.4,6.5
N$24
  Bottom 0.127: R12.2 71,39.2 69.7,39.2 68.3,37.8 68.3,36.5 T1.1
N$25  (via drill 0.25)
  Top 0.127: v100.9,18 99.4,19.5 v94.5,19.5 93.4,18.4 86,18.4 85.6,18 v85,18 | v103.7,7.2 104,7.5 111.9,7.5 112.8,6.6 113.1,6.6 114.1,5.6 114.1,4.4 115.1,3.4 X3.4 | C30.1 55.6,13.3 55.7,13.2 v56.8,13.2 | v59.8,13.2 60.2,13.2 v62.9,10.5
  Route2 0.127: v83.4,16 83.4,16.4 v85,18
  Bottom 0.127: IC1.8 94.4,19.4 v94.5,19.5 | v100.9,18 100.9,17.2 102.6,15.5 102.6,8.3 v103.7,7.2 | v59.8,13.2 v56.8,13.2 | v62.9,10.5 63.2,10.8 72.5,10.8 73.1,10.2 73.5,10.2 73.9,10.6 73.9,11.4 75.4,12.9 77,12.9 77.3,12.6 79.6,12.6 83,16 v83.4,16
N$26  (via drill 0.25)
  Top 0.127: v115.5,33 114.8,32.3 112.4,32.3 v109.5,35.2
  Bottom 0.127: v115.5,33 115.5,32.6 115.2,32.3 IC8.34 | v109.5,35.2 109.5,35.6 105.4,39.7 104,39.7 103.7,40 102.3,40 102,40.3 100.6,40.3 100.3,40.6 98.9,40.6 98.6,40.9 97.2,40.9 96.9,41.2 95.5,41.2 95.2,41.5 93.8,41.5 93.5,41.8 92.1,41.8 91.8,42.1 90.4,42.1 90.1,42.4 88.7,42.4 88.4,42.7 87,42.7 86.7,43 85.3,43 85,43.3 83.6,43.3 83.3,43.6 81.9,43.6 81.6,43.9 80.2,43.9 79.9,44.2 78.5,44.2 78.2,44.5 76.8,44.5 76.5,44.8 75.1,44.8 74.8,45.1 73.4,45.1 72.7,45.8 DISPLAY1.SEG05
N$27  (via drill 0.25)
  Route3 0.127: v88,27 88,27.9 87.6,28.3 87.2,28.3 85.5,30 85.5,31.3 v85,31.8
  Bottom 0.127: Q1.2 78,30.3 81,30.3 81.1,30.4 C6.2 83.6,30.4 83.7,30.5 83.7,31.1 84.4,31.8 v85,31.8 | IC1.24 87.4,25.6 87.5,25.7 87.5,26.2 87.7,26.4 87.7,26.7 v88,27
N$28
  Bottom 0.127: R32.2 189,21.6 187.8,21.6 187.6,21.4 187.6,20.4 187.2,20 185.3,20 184.9,20.4 T4.4
N$29
  Bottom 0.127: DISPLAY1.SEG06 74.5,45.8 75.2,45.1 76.6,45.1 76.9,44.8 78.3,44.8 78.6,44.5 80,44.5 80.3,44.2 81.7,44.2 82,43.9 83.4,43.9 83.7,43.6 85.1,43.6 85.4,43.3 86.8,43.3 87.1,43 88.5,43 88.8,42.7 90.2,42.7 90.5,42.4 91.9,42.4 92.2,42.1 93.6,42.1 93.9,41.8 95.3,41.8 95.6,41.5 97,41.5 97.3,41.2 98.7,41.2 99,40.9 100.4,40.9 100.7,40.6 102.1,40.6 102.4,40.3 103.8,40.3 104.1,40 105.5,40 112.7,32.8 114.4,32.8 IC8.35
N$30  (via drill 0.25)
  Top 0.127: v119.5,28.9 119.5,40.8 124.9,46.2 DISPLAY1.COM1
  Bottom 0.127: v119.5,28.9 119.8,28.9 119.9,29 119.9,29.8 IC8.25
N$31  (via drill 0.25)
  Top 0.127: v87.7,24.8 87.3,24.4 86.7,24.4 86.4,24.1 84,24.1 83.3,23.4 v83.3,23
  Bottom 0.127: v87.7,24.8 IC1.23 | v83.3,23 83.3,24.4 C5.2 79.9,24.4 78,22.5 Q1.1
N$32  (via drill 0.25)
  Top 0.127: SW20.3 171.4,27.3 163.6,27.3 SW20.4 163.5,27.3 162.2,27.3 162.1,27.2 161.8,27.2 v159.3,24.7 | v140.7,30.1 138.1,32.7 IC5.20 | v149.9,24.3 v148.3,24.3
  Bottom 0.127: v140.7,30.1 142.5,30.1 144.1,28.5 144.5,28.5 148.3,24.7 v148.3,24.3 | v149.9,24.3 158.9,24.3 v159.3,24.7
N$33  (via drill 0.25)
  Top 0.127: LED06.C 57.4,5.5 56.9,6 56.9,7.9 v57.2,8.2 | v72.3,25.7 72,26 72,29.2 72.9,30.1 73.3,30.1 74.2,31 78.4,31 81,33.6 81,34.9 IC3.9
  Bottom 0.127: v57.2,8.2 57.2,8.5 56.6,9.1 56.6,9.7 57,10.1 57.5,10.1 64,16.6 64,19.9 64.8,20.7 65.1,20.7 66.6,22.2 66.6,23.9 67.8,25.1 67.8,25.5 68.3,26 72,26 v72.3,25.7
N$34  (via drill 0.25)
  Top 0.127: v73.4,32.4 74.9,33.9 76.7,33.9 77,33.6 79,33.6 79.1,33.7 79.1,34.9 IC3.12 | v70.2,32.4 70.5,32.1 70.5,24.8 70.1,24.4 v68.9,24.4 | v47.7,8.3 47.4,8.6 40.6,8.6 39.8,7.8 37.7,7.8 36.5,9 LED04.C
  Route3 0.127: v68.9,24.4 67.5,24.4 v59.3,16.2
  Bottom 0.127: v73.4,32.4 73.1,32.7 70.5,32.7 v70.2,32.4 | v59.3,16.2 58.6,15.5 58.6,14.7 58.3,14.4 53.8,14.4 v47.7,8.3
N$35  (via drill 0.25)
  Top 0.127: v78.5,36.1 77.8,35.4 77.8,35 IC3.14 | v54,41.7 52.4,40.1 42.7,40.1 42,40.8 v42,41.2 | v28.6,39.6 28.3,39.9 24.2,39.9 21.3,37 LED02.C
  Route3 0.127: v69.9,44.5 69.4,44.5 69.2,44.3 66.2,44.3 v65.8,44.7
  Bottom 0.127: v78.5,36.1 78.3,36.1 77.8,36.6 77.4,36.6 69.9,44.1 v69.9,44.5 | v65.8,44.7 65.5,44.4 56.7,44.4 v54,41.7 | v42,41.2 30.2,41.2 v28.6,39.6
N$36  (via drill 0.25)
  Top 0.127: v74.5,28.1 76.4,30 78.3,30 78.4,29.9 78.4,29.1 IC3.16 | v85.5,7.5 85.8,7.8 91.9,7.8 94.1,5.6 94.1,4.4 94.2,4.3 96.3,4.3 97.5,5.5 LED10.C
  Route3 0.127: v74.5,28.1 75.1,27.5 75.1,27 75.4,26.7 75.4,25.4 84.2,16.6 84.6,16.6 v85.4,15.8
  Bottom 0.127: v85.4,15.8 85.4,13.8 85.5,13.7 v85.5,7.5
N$37  (via drill 0.25)
  Top 0.127: v156.1,11.5 154.9,10.3 153.6,10.3 IC4.6 | v168.8,32.4 169.2,32.8 172.2,32.8 v173.1,31.9 | LED17.C v178.8,38
  Route3 0.127: v156.1,11.5 156.1,12.9 v160.6,17.4
  Bottom 0.127: v160.6,17.4 160.6,18 164.9,22.3 165.3,22.3 165.9,22.9 166.3,22.9 166.9,23.5 166.9,30.5 v168.8,32.4 | v173.1,31.9 173.3,31.9 176.8,35.4 178.7,35.4 178.8,35.5 v178.8,38
N$38  (via drill 0.25)
  Top 0.127: v97.4,8.5 LED09.C | v74.5,27.2 75.1,27.8 75.1,28.3 76.5,29.7 77.8,29.7 77.8,29.1 IC3.15
  Route3 0.127: v84.4,16 75.1,25.3 75.1,26.6 v74.5,27.2
  Bottom 0.127: v97.4,8.5 97.3,8.4 94.5,8.4 93.9,9 93.9,9.4 93.5,9.8 92.8,9.8 90.7,11.9 90.7,13.5 90,14.2 89.8,14.2 87.6,16.4 84.8,16.4 v84.4,16
N$39  (via drill 0.25)
  Top 0.127: v74.5,36.2 74.8,36.5 75.7,36.5 76.6,35.6 76.6,34.4 77.1,33.9 78.4,33.9 78.4,34.9 IC3.13 | v72.8,39.5 72.8,39.9 68.6,44.1 65.6,44.1 v64.7,45 | v54,42.6 53.4,42 53.4,41.5 52.3,40.4 43.2,40.4 v42.9,40.7 | LED01.C v22.5,39
  Route2 0.127: v74.5,36.2 72.8,37.9 v72.8,39.5
  Bottom 0.127: v64.7,45 64.4,44.7 56.6,44.7 54.5,42.6 v54,42.6 | v42.9,40.7 42.3,40.7 40.4,38.8 38.1,38.8 36,40.9 30.3,40.9 29.2,39.8 29.2,39.4 28.8,39 v22.5,39
N$40  (via drill 0.25)
  Top 0.127: v73.7,31.3 78.3,31.3 80.1,33.1 80.1,33.5 79.7,33.9 79.7,34.9 IC3.11 | v47.6,20.2 47.6,18.5 46.8,17.7 42.7,17.7 v42.4,18 | LED03.C v36.7,18
  Route3 0.127: v68.7,30.7 68.3,30.7 66.1,28.5 59.8,28.5 59.6,28.3 57.6,28.3 49.5,20.2 v47.6,20.2
  Bottom 0.127: v73.7,31.3 72.8,30.4 69,30.4 v68.7,30.7 | v36.7,18 v42.4,18
N$41  (via drill 0.25)
  Top 0.127: v81.7,32.7 81.7,34.9 IC3.8 | v60.2,8.6 60.1,8.5 LED05.C
  Route2 0.127: v81.7,32.7 81.7,32.3 81.4,32 81.4,27.3 80.6,26.5 80.6,21.9 79.9,21.2 79.9,17.2 73.5,10.8 v73.3,10.8
  Bottom 0.127: v73.3,10.8 73,11.1 62.7,11.1 v60.2,8.6
N$42  (via drill 0.25)
  Top 0.127: X5.1 78.9,3.4 80.2,4.7 80.2,7 81.3,8.1 93.6,8.1 v93.9,7.8 | v97.2,6.5 97.5,6.8 100,6.8 101.3,8.1 113.6,8.1 v113.9,7.8 | v148.3,31.3 148,31.6 148,34.3 154.9,41.2 v168.1,41.2
  Bottom 0.127: 172.1,38.7 171.5,38.7 171.4,38.6 168.4,38.6 IC2.3 | 172.1,38.7 172.2,38.6 173.6,38.6 IC2.6 | C20.2 172.4,44 172.3,43.9 172.3,42.5 | 169.8,41.2 169.7,41.3 169.7,42.5 R10.2 | 169.8,41.2 172.2,41.2 172.3,41.3 | 172.3,42.5 172.3,41.3 | 172.3,42.5 R17.1 | v93.9,7.8 95.9,7.8 v97.2,6.5 | v113.9,7.8 137.7,31.6 148,31.6 v148.3,31.3 | 169.8,41.2 v168.1,41.2 | 172.1,38.7 172.1,40.9 172.3,41.1 172.3,41.3
N$43
  Top 0.25: IC3.1 86.2,34.9 86.2,33.1 87.4,31.9 89.8,31.9 89.9,31.8 89.9,30.7 90,30.6 91,30.6 R3.2
N$44  (via drill 0.25)
  Top 0.127: v84.3,30.9 84.3,29.1 IC3.25 | v81.5,26.2 83.6,26.2 83.6,26 R13.2
  Bottom 0.127: v84.3,30.9 84.3,29.8 83.3,28.8 81.3,28.8 81.2,28.7 81.2,26.5 v81.5,26.2
N$45  (via drill 0.25)
  Top 0.127: v118,32.7 v115.7,30.4 | v120.1,32.7 119.8,33 119.8,40.7 124.2,45.1 126,45.1 126.7,45.8 DISPLAY1.COM2
  Bottom 0.127: v115.7,30.4 115.9,30.4 116.5,31 118.7,31 119.4,30.3 IC8.26 | v118,32.7 118.3,32.4 119.8,32.4 v120.1,32.7
N$46  (via drill 0.25)
  Top 0.127: v157.4,12.8 157.4,12.1 157.9,11.6 159.4,11.6 IC4.25 | v154,18.6 154,21.3 154.1,21.4 155.5,21.4 R33.2
  Bottom 0.127: v157.4,12.8 157.8,13.2 157.8,15.2 154.4,18.6 v154,18.6
N$47  (via drill 0.25)
  Top 0.127: v153.1,14.3 152.8,14 152.8,13.5 153.5,13.5 IC4.1 | v152.5,9.6 152.5,9.3 152.2,9 152.2,8.3 151.9,8 151.9,5.3 152.7,4.5 155,4.5 155.1,4.4 155.1,3 R16.2
  Bottom 0.127: v153.1,14.3 153.1,10.2 v152.5,9.6
N$48  (via drill 0.25)
  Top 0.127: v118.6,28.9 119.2,29.5 119.2,38.4 v118.9,38.7 | v120.4,40.2 120.4,40.9 124.3,44.8 126.1,44.8 126.4,45.1 127.8,45.1 128.5,45.8 DISPLAY1.COM3
  Bottom 0.127: v118.6,28.9 118.8,28.9 118.9,29 118.9,29.8 IC8.27 | v120.4,40.2 v118.9,38.7
N$49  (via drill 0.25)
  Top 0.127: v154.9,9.6 153.6,9.6 IC4.7 | v166,23.8 166.3,23.5 169.5,23.5 174.6,28.6 174.8,28.6 175.7,29.5 LED18.C
  Bottom 0.127: v154.9,9.6 155.4,9.6 157.4,11.6 158.3,11.6 158.7,12 158.7,16.9 164.7,22.9 165.1,22.9 v166,23.8
N$50  (via drill 0.5)
  Top 0.25: v175.1,40.9 175.1,38.5 174.6,38 LED17.A v171.8,38 162.9,38 160.9,40 155.8,40 DISPLAY1.A3 | LED15.A 167.4,5.5 167.5,5.6 167.5,8.3 | 167.5,8.3 167.5,8.4 167.4,8.5 LED16.A | C34.+ 166,8.5 LED16.A | v174.7,29.5 LED18.A | v186.9,20.7 186.9,18.1 LED20.A 188.1,18 188.5,17.6 188.5,16 188,15.5 LED19.A 185.4,15.5 185.3,15.4 185.3,15.1 181.9,11.7 178.3,11.7 174.9,8.3 167.5,8.3 | 17.6,37 LED02.A | 17.6,37 17.7,37.1 17.7,38.9 17.6,39 LED01.A | 37,33.6 38.2,33.6 DISPLAY1.A2 | 37,33.6 36,33.6 | 36,33.6 20.9,33.6 17.6,36.9 17.6,37 | 37,33.6 37,38.6 38.2,39.8 38.2,40 DISPLAY1.A1 | 37.5,17.9 37.5,9.1 37.6,9 LED04.A 53.4,9 53.9,8.5 LED05.A 56.4,8.5 56.5,8.4 | 37.5,17.9 37.6,18 LED03.A | LED14.A 136.9,5.5 137,5.6 137,8.1 | 137,8.1 137,8.4 136.9,8.5 LED13.A 121.2,8.5 119.9,7.2 116.5,7.2 | LED12.A 116.4,5.5 116.5,5.6 116.5,7.2 | 116.5,7.2 116.5,8.4 116.4,8.5 LED11.A 101.2,8.5 99.9,7.2 96.5,7.2 | LED10.A 96.4,5.5 96.5,5.6 96.5,7.2 | 96.5,7.2 96.5,8.4 96.4,8.5 LED09.A 81.2,8.5 79.9,7.2 76.5,7.2 | LED08.A 76.4,5.5 76.5,5.6 76.5,7.2 | 76.5,7.2 76.5,8.4 76.4,8.5 LED07.A 74.1,8.5 74,8.6 74,22.9 | LED06.A 56.4,5.5 56.5,5.6 56.5,8.4 | v57.3,9.4 57.3,9.2 56.5,8.4 | C15.+ 78.2,26 78.1,25.9 78.1,25 76,22.9 74,22.9 | v70.4,22.9 74,22.9 | 36,33.6 36,24.2 37.4,22.8 37.4,17.9 37.5,17.9 | v164.8,8.5 LED16.A | 137,8.1 v137.8,8.1
  Bottom 0.25: DISPLAY1.A4 155.7,33.6 155.7,36.1 154.7,37.1 154.7,39 155.7,40 DISPLAY1.A3 | v171.8,38 171.8,36.5 172.2,36.1 172.4,36.1 | 172.4,36.1 IC2.8 | 172.4,36.1 C19.2 C33.+ 173.7,30.5 v174.7,29.5 174.8,29.5 177.4,32.1 184.2,32.1 R18.2 184.3,32.1 185.6,32.1 186.9,30.8 v186.9,20.7 | v175.1,40.9 R17.2 | v57.3,9.4 65.5,17.6 X6.4 65.5,18.9 65.5,20.2 68.2,22.9 v70.4,22.9 | v164.8,8.5 149.8,8.5 148.8,9.5 144.2,9.5 142.8,8.1 v137.8,8.1
N$51  (via drill 0.25)
  Top 0.127: v152.5,7.8 152.5,8.9 152.6,9 153.5,9 IC4.8 | v160.5,6.4 161.4,5.5 LED15.C
  Bottom 0.127: v152.5,7.8 152.8,8.1 158.8,8.1 v160.5,6.4
N$52
  Bottom 0.127: DISPLAY1.SEG07 76.3,45.8 77,45.1 78.4,45.1 78.7,44.8 80.1,44.8 80.4,44.5 81.8,44.5 82.1,44.2 83.5,44.2 83.8,43.9 85.2,43.9 85.5,43.6 86.9,43.6 87.2,43.3 88.6,43.3 88.9,43 90.3,43 90.6,42.7 92,42.7 92.3,42.4 93.7,42.4 94,42.1 95.4,42.1 95.7,41.8 97.1,41.8 97.4,41.5 98.8,41.5 99.1,41.2 100.5,41.2 100.8,40.9 102.2,40.9 102.5,40.6 103.9,40.6 104.2,40.3 105.6,40.3 112.6,33.3 114.4,33.3 IC8.36
N$53
  Bottom 0.127: DISPLAY1.SEG08 78.1,45.8 78.8,45.1 80.2,45.1 80.5,44.8 81.9,44.8 82.2,44.5 83.6,44.5 83.9,44.2 85.3,44.2 85.6,43.9 87,43.9 87.3,43.6 88.7,43.6 89,43.3 90.4,43.3 90.7,43 92.1,43 92.4,42.7 93.8,42.7 94.1,42.4 95.5,42.4 95.8,42.1 97.2,42.1 97.5,41.8 98.9,41.8 99.2,41.5 100.6,41.5 100.9,41.2 102.3,41.2 102.6,40.9 104,40.9 104.3,40.6 105.7,40.6 112.5,33.8 114.4,33.8 IC8.37
N$54
  Bottom 0.127: DISPLAY1.SEG09 79.9,45.8 80.6,45.1 82,45.1 82.3,44.8 83.7,44.8 84,44.5 85.4,44.5 85.7,44.2 87.1,44.2 87.4,43.9 88.8,43.9 89.1,43.6 90.5,43.6 90.8,43.3 92.2,43.3 92.5,43 93.9,43 94.2,42.7 95.6,42.7 95.9,42.4 97.3,42.4 97.6,42.1 99,42.1 99.3,41.8 100.7,41.8 101,41.5 102.4,41.5 102.7,41.2 104.1,41.2 104.4,40.9 105.8,40.9 112.4,34.3 114.4,34.3 IC8.38
N$55  (via drill 0.25)
  Top 0.127: 170.7,19.5 170.7,18.3 172,17 SW22.B | v145.7,30.7 145.7,36.6 IC5.14 | v159.4,23.8 160.7,23.8 162.3,22.2 162.3,21.8 163.1,21 170.6,21 170.7,20.9 170.7,19.5 | 170.7,19.5 C21.2
  Route2 0.127: v149.9,28.1 151.8,26.2 157.6,26.2 157.9,25.9 157.9,25.3 v159.4,23.8
  Bottom 0.127: v145.7,30.7 146,31 147.4,31 149.9,28.5 v149.9,28.1
N$56  (via drill 0.25)
  Top 0.127: v103,23.2 102.6,23.6 v99.2,23.6 | v82.1,16.3 82.1,15 84.3,12.8 SWR/CAL.3
  Route3 0.127: v65.6,39 66.3,38.3 66.3,37.5 75.4,28.4 75.4,28 75.7,27.7 75.7,27.2 76,26.9 76,25.6 80.5,21.1 84.3,21.1 86.4,19 v86.8,19
  Bottom 0.127: v103,23.2 IC1.60 | v99.2,23.6 94.8,23.6 94.1,22.9 90.7,22.9 v86.8,19 84.8,17 83.2,17 82.5,16.3 v82.1,16.3 | v65.6,39 65.4,39 64.3,40.1 59.1,40.1 58.1,39.1 57.5,39.1 57.5,40.1 X7.1
N$57  (via drill 0.25)
  Top 0.127: v21.5,25.1 21.2,25.4 20.5,25.4 20.4,25.3 20.4,24.1 SW04.3 | v21.5,26.5 21.5,29.5 20.4,30.6 20.4,31.9 SW04.4 20.4,32 20.4,33.1 20.5,33.2 34.7,33.2 35.6,32.3 35.6,30.3 v35.3,30 | v52.9,33 53.8,33 54.8,34 54.8,36.6 IC6.9
  Bottom 0.127: v21.5,26.5 v21.5,25.1 | v52.9,33 52.3,33.6 48.7,33.6 45.1,30 v35.3,30
N$58  (via drill 0.25)
  Top 0.127: SW03.4 4.8,30.3 12.7,30.3 SW03.3 12.8,30.3 14.1,30.3 v15.2,29.2 | v50.9,32.4 53.1,32.4 53.4,32.7 53.9,32.7 56.1,34.9 IC6.8
  Route3 0.127: v50.9,32.4 50.2,32.4 v47.2,29.4
  Bottom 0.127: v47.2,29.4 40.6,29.4 40,28.8 15.6,28.8 v15.2,29.2
N$59  (via drill 0.25)
  Top 0.127: SW02.3 22.1,35.8 29.9,35.8 SW02.4 30,35.8 31.3,35.8 31.5,35.6 v36.2,35.6 | v51.2,38.3 56.9,38.3 57.4,37.8 57.4,36.6 IC6.7
  Bottom 0.127: v51.2,38.3 47.4,34.5 39.9,34.5 39.4,35 36.8,35 v36.2,35.6
N$60  (via drill 0.25)
  Top 0.127: SW10.3 94.9,21.8 87.1,21.8 SW10.4 87,21.8 85.7,21.8 85,22.5 v85,23.3 | v58.6,33.6 58.6,36.6 IC6.6
  Route3 0.127: v65.8,32.8 68.7,32.8 v68.8,32.7 | v74.5,32.7 75.1,32.7 75.4,32.4 76.2,32.4 85,23.6 v85,23.3
  Bottom 0.127: v58.6,33.6 58.9,33.9 64.7,33.9 v65.8,32.8 | v68.8,32.7 69.1,33 74.2,33 v74.5,32.7
N$61  (via drill 0.25)
  Top 0.127: SW11.3 106.4,21.8 98.6,21.8 SW11.4 98.5,21.8 97.2,21.8 97.1,21.9 97.1,24.1 95.1,26.1 v94.6,26.1 | v59.9,33.3 IC6.5
  Route2 0.127: v64.5,33.3 65.5,33.3 67.3,35.1 v69.5,35.1
  Route3 0.127: v92.5,31 v88.5,35
  Bottom 0.127: v59.9,33.3 60.2,33.6 64.2,33.6 v64.5,33.3 | v69.5,35.1 69.8,34.8 86.6,34.8 87.4,35.6 87.9,35.6 v88.5,35 | v92.5,31 94.9,28.6 94.9,26.4 v94.6,26.1
N$62  (via drill 0.25)
  Top 0.127: SW12.3 117.9,21.8 110.1,21.8 SW12.4 110,21.8 108.7,21.8 108,22.5 108,31.9 104,35.9 99.9,35.9 98.3,37.5 87.7,37.5 87.4,37.8 85.7,37.8 85.4,38.1 84.1,38.1 83.3,38.9 69.1,38.9 v68.5,39.5 | v62.5,39.2 61.2,37.9 61.2,36.6 IC6.4
  Route2 0.127: v62.5,39.2 63.4,40.1 64.3,40.1 64.9,39.5 65.3,39.5 65.6,39.8 67,39.8 67.3,39.5 v68.5,39.5
N$63  (via drill 0.25)
  Top 0.127: SW22.A 177.6,17 178.9,18.3 178.9,19.5 C22.2 | v142.7,29.1 142.7,31.9 144.4,33.6 144.4,36.6 IC5.15 | v150.6,23.6 v148.9,23.6 | v160.1,23.2 160.9,23.2 162,22.1 162,21.7 163,20.7 169,20.7 v169.3,20.4
  Bottom 0.127: v142.7,29.1 143.1,29.1 144,28.2 144.4,28.2 147.7,24.9 147.7,24.1 148.2,23.6 v148.9,23.6 | v150.6,23.6 151,24 158.4,24 159.2,23.2 v160.1,23.2 | v169.3,20.4 173.9,20.4 177.3,17 SW22.A
N$64
  Top 0.127: 53.6,21.8 52.6,21.8 SW07.4 | 53.6,21.8 53.7,21.9 53.7,25.9 53.6,26 53.6,27.4 IC6.15 | 53.6,21.8 60.4,21.8 SW07.3
N$65  (via drill 0.25)
  Top 0.127: SW08.3 71.9,21.8 70.6,21.8 70.2,21.4 68.9,21.4 68.5,21.8 64.1,21.8 SW08.4 64,21.8 v62.7,21.8 | v60.1,24.4 56.6,24.4 54.8,26.2 54.8,27.4 IC6.16
  Route2 0.127: v62.7,21.8 v60.1,24.4
N$66  (via drill 0.25)
  Top 0.127: v81.5,23 81.5,22.6 80.7,21.8 75.6,21.8 SW09.4 75.5,21.8 74.5,21.8 74.4,21.7 74.4,20.4 v75.8,19 | v81.5,20.2 81.5,21.2 82.1,21.8 83.4,21.8 SW09.3 | v59.9,25.3 59.3,24.7 56.7,24.7 56.1,25.3 IC6.17
  Bottom 0.127: v81.5,23 81.2,22.7 81.2,20.5 v81.5,20.2 | v59.9,25.3 60.9,26.3 73.7,26.3 75.8,24.2 v75.8,19
N$67
  Top 0.127: SW13.4 121.6,21.8 129.4,21.8 SW13.3 129.5,21.8 130.8,21.8 131.8,22.8 133.4,22.8 136.8,26.2 136.8,27.4 IC5.4
N$68  (via drill 0.25)
  Top 0.127: v102.6,7.5 102.9,7.8 112.4,7.8 v112.7,7.5
  Bottom 0.127: IC1.4 97.6,17 98.2,16.4 101.3,16.4 102.3,15.4 102.3,7.8 v102.6,7.5 | v112.7,7.5 116.6,3.6 116.6,3.4 X3.3
N$69  (via drill 0.25)
  Top 0.127: v98.6,36.2 98.9,35.9 99.5,35.9 99.8,35.6 103.9,35.6 107.7,31.8 v107.7,18.7 | C28.2 38.9,20.3 39,20.2 v45.2,20.2 | v72.5,32.1 72.5,32.3 73.2,33 73.6,33 v76,35.4
  Route3 0.127: v114,9.8 114,9.2 118.1,5.1 118.1,4.9 119.1,3.9 119.1,3.4 X3.1 | v45.2,20.2 46.8,20.2 47.4,19.6 51.2,19.6 51.9,20.3 51.9,22.2 57.7,28 59.7,28 59.9,28.2 66.2,28.2 68.1,30.1 68.9,30.1 v69.8,31
  Bottom 0.127: IC1.39 92.8,35 94,36.2 | 94,36.2 95.2,37.4 96.8,37.4 98,36.2 v98.6,36.2 | v107.7,18.7 107.7,17.8 111.3,14.2 111.3,12.1 112.7,10.7 113.1,10.7 v114,9.8 | v69.8,31 71.2,32.4 72.2,32.4 v72.5,32.1 | v76,35.4 76.3,35.1 86.5,35.1 87.3,35.9 90.8,35.9 92.3,37.4 92.8,37.4 94,36.2
N$70  (via drill 0.25)
  Top 0.127: v55.6,10.3 C29.2 | v78.8,16.9 79.4,16.9 80.2,17.7 81.8,17.7 84.3,20.2 93.2,20.2 93.4,20.4 v99.8,20.4
  Route2 0.127: v71.9,10.2 73.1,11.4 73.7,11.4 78.8,16.5 v78.8,16.9
  Route3 0.127: v92.5,36.8 92.5,35.5 v99.8,28.2 | v112.9,10.1 112.9,9.9 117.8,5 117.8,3.4 X3.2
  Bottom 0.127: IC1.38 92,36.3 v92.5,36.8 | v99.8,28.2 100.1,27.9 100.1,22.5 100,22.4 100,20.4 | 100,20.4 100,20.2 101,19.2 105.9,19.2 111,14.1 111,12 v112.9,10.1 | v55.6,10.3 56.3,9.6 56.3,9 56.6,8.7 56.6,8 57,7.6 60,7.6 60.8,8.4 60.8,8.8 61.9,9.9 71.6,9.9 v71.9,10.2 | 100,20.4 v99.8,20.4
N$71  (via drill 0.25)
  Top 0.127: SW21.3 185.9,27.3 178.1,27.3 SW21.4 178,27.3 176.7,27.3 176,28 174.8,28 171.2,24.4 v171.2,24 | v138.7,32.9 139.4,33.6 139.4,36.6 IC5.19 | v151.3,23 v149.6,23 | v159.4,22.6 161.1,22.6 161.7,22 161.7,21.6 162.9,20.4 167,20.4 v167.3,20.1
  Route2 0.127: v138.7,32.9 138.7,31.3 v139,31
  Bottom 0.127: v139,31 141.5,28.5 143.3,28.5 143.9,27.9 144.3,27.9 147.4,24.8 147.4,24 148.1,23.3 148.4,23.3 148.7,23 v149.6,23 | v151.3,23 152,23.7 158.3,23.7 v159.4,22.6 | v171.2,24 v167.3,20.1
N$72
  Top 0.127: 168.7,39.8 171.4,39.8 SW16.4 | 168.7,39.8 163.6,39.8 SW16.3 | 168.7,39.8 168.7,41.4 168.3,41.8 167.9,41.8 167.6,41.5 154.8,41.5 151.4,38.1 143.5,38.1 143.2,37.8 143.2,36.6 IC5.16
N$73  (via drill 0.25)
  Top 0.127: SW18.4 171.4,31.8 163.6,31.8 SW18.3 163.5,31.8 162.2,31.8 162.1,31.9 161.6,31.9 159.3,29.6 v159.3,29.2 | v140.6,31 140.6,36.6 IC5.18
  Bottom 0.127: v140.6,31 140.9,31.3 147.5,31.3 150.4,28.4 158.5,28.4 v159.3,29.2
N$74
  Bottom 0.127: IC8.21 121.9,29.8 121.9,28.8 120.9,27.8 120.9,25.8 120.8,25.7 116.9,25.7 116.8,25.8 116.8,27 R30.2
N$75  (via drill 0.25)
  Top 0.127: v95.2,25.2 v95.2,23 | v92.5,32.6 v94.8,30.3 | v36.3,34.7 35.6,34 21.4,34 v21.1,34.3 | v15.1,34.3 15.4,34.6 15.4,35.6 15.2,35.8 14.3,35.8 SW01.4 14.2,35.8 6.3,35.8 SW01.3
  Bottom 0.127: v95.2,23 IC1.7 | v95.2,25.2 95.2,29.9 v94.8,30.3 | v92.5,32.6 92.2,32.3 87.9,32.3 86,34.2 39.8,34.2 39.3,34.7 v36.3,34.7 | v15.1,34.3 v21.1,34.3
N$76
  Bottom 0.127: DISPLAY1.SEG10 81.7,45.8 82.4,45.1 83.8,45.1 84.1,44.8 85.5,44.8 85.8,44.5 87.2,44.5 87.5,44.2 88.9,44.2 89.2,43.9 90.6,43.9 90.9,43.6 92.3,43.6 92.6,43.3 94,43.3 94.3,43 95.7,43 96,42.7 97.4,42.7 97.7,42.4 99.1,42.4 99.4,42.1 100.8,42.1 101.1,41.8 102.5,41.8 102.8,41.5 104.2,41.5 104.5,41.2 105.9,41.2 112.3,34.8 114.4,34.8 IC8.39
N$77
  Bottom 0.127: DISPLAY1.SEG11 83.5,45.8 84.2,45.1 85.6,45.1 85.9,44.8 87.3,44.8 87.6,44.5 89,44.5 89.3,44.2 90.7,44.2 91,43.9 92.4,43.9 92.7,43.6 94.1,43.6 94.4,43.3 95.8,43.3 96.1,43 97.5,43 97.8,42.7 99.2,42.7 99.5,42.4 100.9,42.4 101.2,42.1 102.6,42.1 102.9,41.8 104.3,41.8 104.6,41.5 106,41.5 112.2,35.3 114.4,35.3 IC8.40
N$78
  Bottom 0.127: DISPLAY1.SEG12 85.3,45.8 86,45.1 87.4,45.1 87.7,44.8 89.1,44.8 89.4,44.5 90.8,44.5 91.1,44.2 92.5,44.2 92.8,43.9 94.2,43.9 94.5,43.6 95.9,43.6 96.2,43.3 97.6,43.3 97.9,43 99.3,43 99.6,42.7 101,42.7 101.3,42.4 102.7,42.4 103,42.1 104.4,42.1 104.7,41.8 106.1,41.8 112.1,35.8 114.4,35.8 IC8.41
N$79
  Bottom 0.127: DISPLAY1.SEG13 87.1,45.8 87.8,45.1 89.2,45.1 89.5,44.8 90.9,44.8 91.2,44.5 92.6,44.5 92.9,44.2 94.3,44.2 94.6,43.9 96,43.9 96.3,43.6 97.7,43.6 98,43.3 99.4,43.3 99.7,43 101.1,43 101.4,42.7 102.8,42.7 103.1,42.4 104.5,42.4 104.8,42.1 106.2,42.1 112,36.3 114.4,36.3 IC8.42
N$80
  Bottom 0.127: DISPLAY1.SEG14 88.9,45.8 89.6,45.1 91,45.1 91.3,44.8 92.7,44.8 93,44.5 94.4,44.5 94.7,44.2 96.1,44.2 96.4,43.9 97.8,43.9 98.1,43.6 99.5,43.6 99.8,43.3 101.2,43.3 101.5,43 102.9,43 103.2,42.7 104.6,42.7 104.9,42.4 106.3,42.4 106.6,42.1 108,42.1 113.3,36.8 114.4,36.8 IC8.43
N$81
  Bottom 0.127: DISPLAY1.SEG15 90.7,45.8 91.4,45.1 92.8,45.1 93.1,44.8 94.5,44.8 94.8,44.5 96.2,44.5 96.5,44.2 97.9,44.2 98.2,43.9 99.6,43.9 99.9,43.6 101.3,43.6 101.6,43.3 103,43.3 103.3,43 104.7,43 105,42.7 106.4,42.7 106.7,42.4 108.1,42.4 113.2,37.3 114.4,37.3 IC8.44
N$82
  Bottom 0.127: DISPLAY1.SEG16 92.5,45.8 93.2,45.1 94.6,45.1 94.9,44.8 96.3,44.8 96.6,44.5 98,44.5 98.3,44.2 99.7,44.2 100,43.9 101.4,43.9 101.7,43.6 103.1,43.6 103.4,43.3 104.8,43.3 105.1,43 106.5,43 106.8,42.7 108.2,42.7 113.1,37.8 114.4,37.8 IC8.45
N$83
  Bottom 0.127: DISPLAY1.SEG17 94.3,45.8 95,45.1 96.4,45.1 96.7,44.8 98.1,44.8 98.4,44.5 99.8,44.5 100.1,44.2 101.5,44.2 101.8,43.9 103.2,43.9 103.5,43.6 104.9,43.6 105.2,43.3 106.6,43.3 106.9,43 108.3,43 113,38.3 114.4,38.3 IC8.46
N$84
  Bottom 0.127: DISPLAY1.SEG18 96.1,45.8 96.8,45.1 98.2,45.1 98.5,44.8 99.9,44.8 100.2,44.5 101.6,44.5 101.9,44.2 103.3,44.2 103.6,43.9 105,43.9 105.3,43.6 106.7,43.6 107,43.3 108.4,43.3 112.9,38.8 114.4,38.8 IC8.47
N$85
  Bottom 0.127: DISPLAY1.SEG19 97.9,45.8 98.6,45.1 100,45.1 100.3,44.8 101.7,44.8 102,44.5 103.4,44.5 103.7,44.2 105.1,44.2 105.4,43.9 106.8,43.9 107.1,43.6 108.5,43.6 108.8,43.3 110.2,43.3 110.5,43 111.9,43 112.2,42.7 113.6,42.7 113.9,42.4 115.3,42.4 115.6,42.1 116.4,42.1 IC8.49
N$86
  Bottom 0.127: DISPLAY1.SEG20 99.7,45.8 100.4,45.1 101.8,45.1 102.1,44.8 103.5,44.8 103.8,44.5 105.2,44.5 105.5,44.2 106.9,44.2 107.2,43.9 108.6,43.9 108.9,43.6 110.3,43.6 110.6,43.3 112,43.3 112.3,43 113.7,43 114,42.7 115.4,42.7 115.7,42.4 116.8,42.4 116.9,42.3 IC8.50
N$87